# EAGLE design ATCUxxxl3U_Synth_4layer (EAGLE 5.11)
MPN: BZT55C3V6; OC_NEWARK: 01P3361

## Sheet 1 of 9
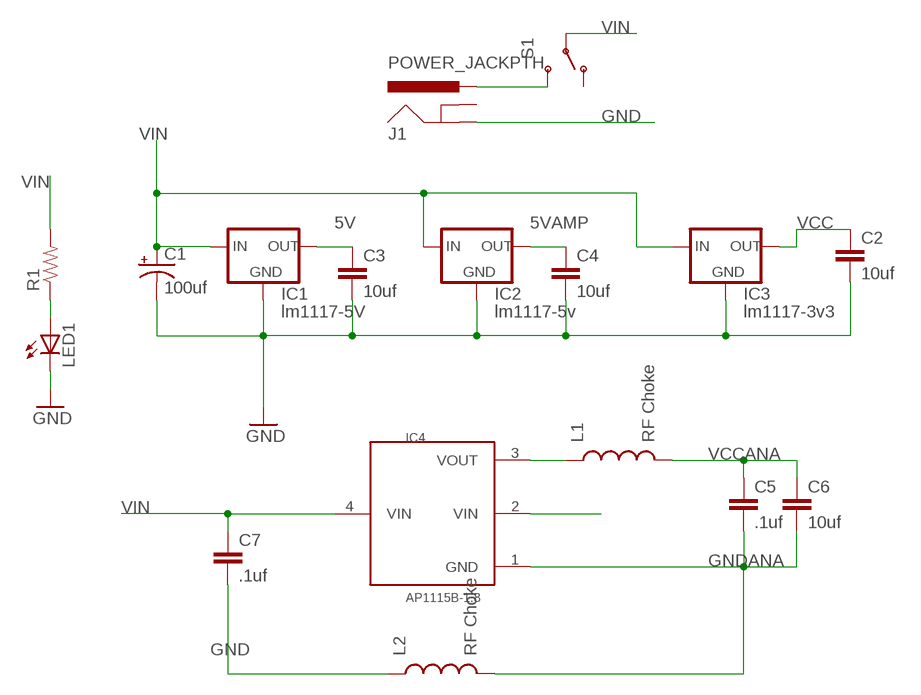
[diagram p0: schematic, sheet 1]

### Parts
C1  100uf  CAP_POL7343  [EIA7343]
C2  10uf  CAP0805  [0805]
C3  10uf  CAP0805  [0805]
C4  10uf  CAP0805  [0805]
C5  .1uf  CAP0805  [0805]
C6  10uf  CAP0805  [0805]
C7  .1uf  CAP0805  [0805]
IC1  lm1117-5V  V-REG-3_LM1117  [V-REG-3_SOT223]
IC2  lm1117-5v  V-REG-3_LM1117  [V-REG-3_SOT223]
IC3  lm1117-3v3  V-REG-3_LM1117  [V-REG-3_SOT223]
IC4  AP1115B-1.8  AP1115  [SOT89-3L]
J1  POWER_JACKPTH  [POWER_JACK_PTH]
L1  RF Choke  INDUCTOR0805  [0805]
L2  RF Choke  INDUCTOR0805  [0805]
LED1  LEDCHIPLED_1206  [CHIPLED_1206]
R1  RESISTOR0805-RES  [0805]
S1  SWITCH-SPSTPTH  [SWITCH-SPDT]

### Nets
5V: C3.1 IC1.2(OUT) ; also sheet 6
5VAMP: C4.1 IC2.2(OUT) ; also sheet 4
GND: C1.C(-) C2.2 C3.2 C4.2 C7.2 IC1.1(GND) IC2.1(GND) IC3.1(GND) J1.GND L2.1 LED1.C ; also sheet 2,4,5,6,7,8
GNDANA: C5.2 C6.2 IC4.1(GND) L2.2 ; also sheet 2,5
N$20: J1.PWR S1.3(S)
N$23: LED1.A R1.1
N$26: IC4.3(VOUT) L1.1
VCC: C2.1 IC3.2(OUT) ; also sheet 2,5,6,7
VCCANA: C5.1 C6.1 L1.2 ; also sheet 2,5
VIN: C1.A(+) C7.1 IC1.3(IN) IC2.3(IN) IC3.3(IN) IC4.2(VIN) IC4.4(VIN) R1.2 S1.2(P)
Unconnected: J1.GNDBREAK S1.1(O)

## Sheet 2 of 9
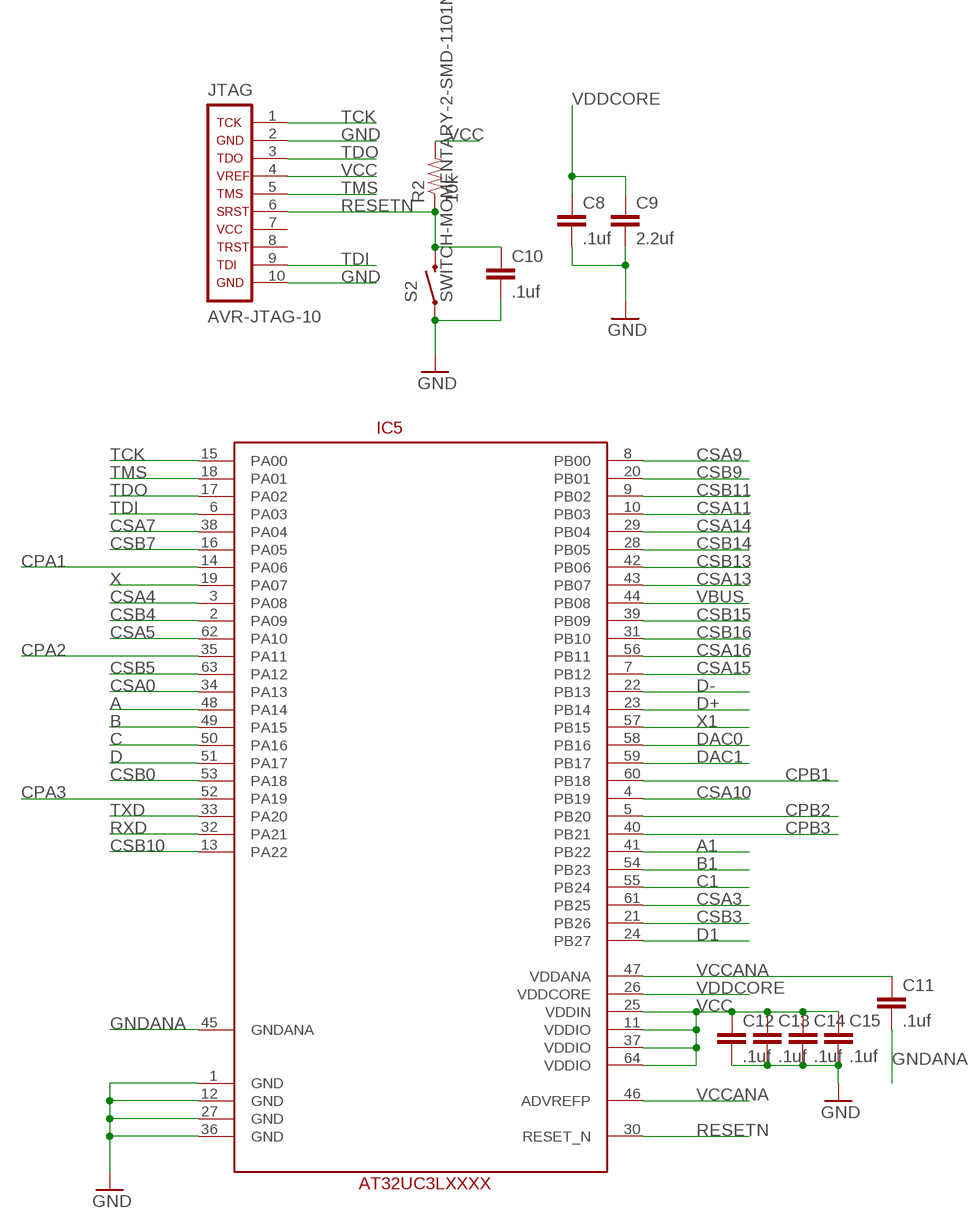
[diagram p1: schematic, sheet 2]

### Parts
C8  .1uf  CAP0805  [0805]
C9  2.2uf  CAP0805  [0805]
C10  .1uf  CAP0805  [0805]
C11  .1uf  CAP0805  [0805]
C12  .1uf  CAP0805  [0805]
C13  .1uf  CAP0805  [0805]
C14  .1uf  CAP0805  [0805]
C15  .1uf  CAP0805  [0805]
IC5  ATCXXXL3U  [TQFP64]
JTAG  AVR-JTAG-10  [AVR-JTAG-10]
R2  10k  RESISTOR0805-RES  [0805]
S2  SWITCH-MOMENTARY-2-SMD-1101NE  [TACTILE-SWITCH-1101NE]

### Nets
A: IC5.48(PA14) ; also sheet 7
A1: IC5.41(PB22) ; also sheet 5
B: IC5.49(PA15) ; also sheet 7
B1: IC5.54(PB23) ; also sheet 5
C: IC5.50(PA16) ; also sheet 7
C1: IC5.55(PB24) ; also sheet 5
CPA1: IC5.14(PA06) ; also sheet 9
CPA2: IC5.35(PA11) ; also sheet 9
CPA3: IC5.52(PA19) ; also sheet 9
CPB1: IC5.60(PB18) ; also sheet 9
CPB2: IC5.5(PB20) ; also sheet 9
CPB3: IC5.40(PB21) ; also sheet 9
CSA0: IC5.34(PA13) ; also sheet 3
CSA3: IC5.61(PB25) ; also sheet 3
CSA4: IC5.3(PA08) ; also sheet 3
CSA5: IC5.62(PA10) ; also sheet 3
CSA7: IC5.38(PA04) ; also sheet 3
CSA9: IC5.8(PB00) ; also sheet 3
CSA10: IC5.4(PB19) ; also sheet 3
CSA11: IC5.10(PB03) ; also sheet 3
CSA13: IC5.43(PB07) ; also sheet 3
CSA14: IC5.29(PB04) ; also sheet 3
CSA15: IC5.7(PB12) ; also sheet 3
CSA16: IC5.56(PB11) ; also sheet 3
CSB0: IC5.53(PA18) ; also sheet 3
CSB3: IC5.21(PB26) ; also sheet 3
CSB4: IC5.2(PA09) ; also sheet 3
CSB5: IC5.63(PA12) ; also sheet 3
CSB7: IC5.16(PA05) ; also sheet 3
CSB9: IC5.20(PB01) ; also sheet 3
CSB10: IC5.13(PA22) ; also sheet 3
CSB11: IC5.9(PB02) ; also sheet 3
CSB13: IC5.42(PB06) ; also sheet 3
CSB14: IC5.28(PB05) ; also sheet 3
CSB15: IC5.39(PB09) ; also sheet 3
CSB16: IC5.31(PB10) ; also sheet 3
D: IC5.51(PA17) ; also sheet 7
D1: IC5.24(PB27) ; also sheet 5
D+: IC5.23(PB14) ; also sheet 8
D-: IC5.22(PB13) ; also sheet 8
DAC0: IC5.58(PB16) ; also sheet 4
DAC1: IC5.59(PB17) ; also sheet 4
GND: C8.2 C9.2 C10.2 C12.2 C13.2 C14.2 C15.2 IC5.1(GND) IC5.12(GND) IC5.27(GND) IC5.36(GND) JTAG.2 JTAG.10 S2.P$1 ; also sheet 1,4,5,6,7,8
GNDANA: C11.2 IC5.45(GNDANA) ; also sheet 1,5
RESETN: C10.1 IC5.30(RESET_N) JTAG.6 R2.1 S2.P$2
RXD: IC5.32(PA21) ; also sheet 6
TCK: IC5.15(PA00) JTAG.1
TDI: IC5.6(PA03) JTAG.9
TDO: IC5.17(PA02) JTAG.3
TMS: IC5.18(PA01) JTAG.5
TXD: IC5.33(PA20) ; also sheet 6
VBUS: IC5.44(PB08) ; also sheet 8
VCC: C12.1 C13.1 C14.1 C15.1 IC5.11(VDDIO) IC5.25(VDDIN) IC5.37(VDDIO) IC5.64(VDDIO) JTAG.4 R2.2 ; also sheet 1,5,6,7
VCCANA: C11.1 IC5.46(ADVREFP) IC5.47(VDDANA) ; also sheet 1,5
VDDCORE: C8.1 C9.1 IC5.26(VDDCORE)
X: IC5.19(PA07) ; also sheet 7
X1: IC5.57(PB15) ; also sheet 5
Unconnected: JTAG.7 JTAG.8

## Sheet 3 of 9
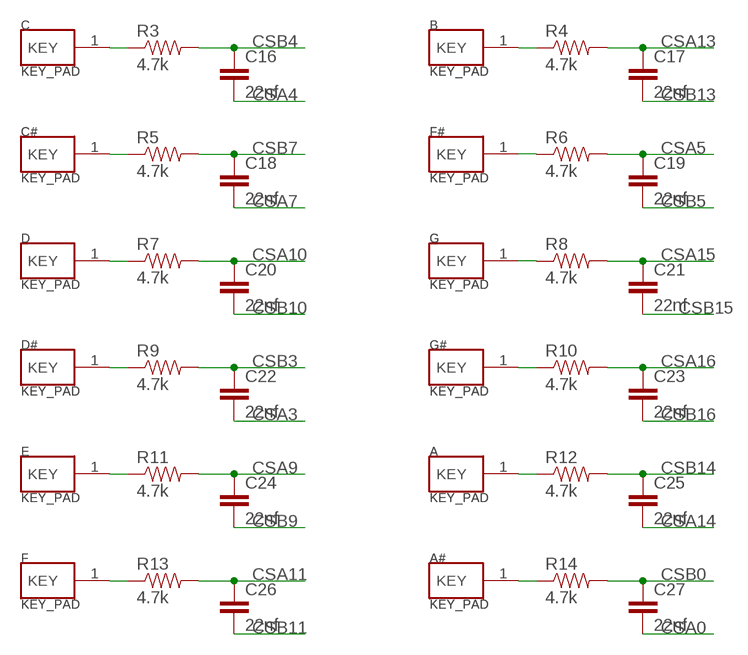
[diagram p2: schematic, sheet 3]

### Parts
A  KEY_PAD  [KEY_PAD]
A#  KEY_PAD  [KEY_PAD]
B  KEY_PAD  [KEY_PAD]
C  KEY_PAD  [KEY_PAD]
C16  22nf  CAP0805  [0805]
C17  22nf  CAP0805  [0805]
C18  22nf  CAP0805  [0805]
C19  22nf  CAP0805  [0805]
C20  22nf  CAP0805  [0805]
C21  22nf  CAP0805  [0805]
C22  22nf  CAP0805  [0805]
C23  22nf  CAP0805  [0805]
C24  22nf  CAP0805  [0805]
C25  22nf  CAP0805  [0805]
C26  22nf  CAP0805  [0805]
C27  22nf  CAP0805  [0805]
C#  KEY_PAD  [KEY_PAD]
D  KEY_PAD  [KEY_PAD]
D#  KEY_PAD  [KEY_PAD]
E  KEY_PAD  [KEY_PAD]
F  KEY_PAD  [KEY_PAD]
F#  KEY_PAD  [KEY_PAD]
G  KEY_PAD  [KEY_PAD]
G#  KEY_PAD  [KEY_PAD]
R3  4.7k  RESISTOR0805-RES  [0805]
R4  4.7k  RESISTOR0805-RES  [0805]
R5  4.7k  RESISTOR0805-RES  [0805]
R6  4.7k  RESISTOR0805-RES  [0805]
R7  4.7k  RESISTOR0805-RES  [0805]
R8  4.7k  RESISTOR0805-RES  [0805]
R9  4.7k  RESISTOR0805-RES  [0805]
R10  4.7k  RESISTOR0805-RES  [0805]
R11  4.7k  RESISTOR0805-RES  [0805]
R12  4.7k  RESISTOR0805-RES  [0805]
R13  4.7k  RESISTOR0805-RES  [0805]
R14  4.7k  RESISTOR0805-RES  [0805]

### Nets
CSA0: C27.2 ; also sheet 2
CSA3: C22.2 ; also sheet 2
CSA4: C16.2 ; also sheet 2
CSA5: C19.1 R6.2 ; also sheet 2
CSA7: C18.2 ; also sheet 2
CSA9: C24.1 R11.2 ; also sheet 2
CSA10: C20.1 R7.2 ; also sheet 2
CSA11: C26.1 R13.2 ; also sheet 2
CSA13: C17.1 R4.2 ; also sheet 2
CSA14: C25.2 ; also sheet 2
CSA15: C21.1 R8.2 ; also sheet 2
CSA16: C23.1 R10.2 ; also sheet 2
CSB0: C27.1 R14.2 ; also sheet 2
CSB3: C22.1 R9.2 ; also sheet 2
CSB4: C16.1 R3.2 ; also sheet 2
CSB5: C19.2 ; also sheet 2
CSB7: C18.1 R5.2 ; also sheet 2
CSB9: C24.2 ; also sheet 2
CSB10: C20.2 ; also sheet 2
CSB11: C26.2 ; also sheet 2
CSB13: C17.2 ; also sheet 2
CSB14: C25.1 R12.2 ; also sheet 2
CSB15: C21.2 ; also sheet 2
CSB16: C23.2 ; also sheet 2
N$1: C.1(KEY) R3.1
N$2: C#.1(KEY) R5.1
N$3: D.1(KEY) R7.1
N$4: D#.1(KEY) R9.1
N$5: E.1(KEY) R11.1
N$6: F.1(KEY) R13.1
N$7: A#.1(KEY) R14.1
N$8: B.1(KEY) R4.1
N$9: A.1(KEY) R12.1
N$10: G#.1(KEY) R10.1
N$11: G.1(KEY) R8.1
N$12: F#.1(KEY) R6.1

## Sheet 4 of 9
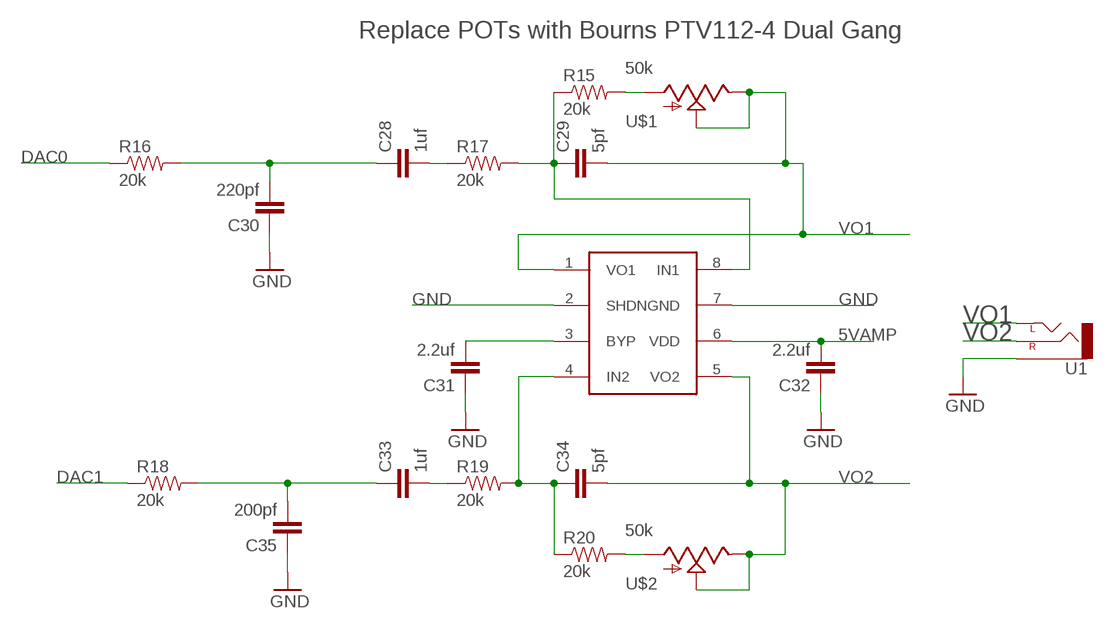
[diagram p3: schematic, sheet 4]

### Parts
C28  1uf  CAP0805  [0805]
C29  5pf  CAP0805  [0805]
C30  220pf  CAP0805  [0805]
C31  2.2uf  CAP0805  [0805]
C32  2.2uf  CAP0805  [0805]
C33  1uf  CAP0805  [0805]
C34  5pf  CAP0805  [0805]
C35  200pf  CAP0805  [0805]
IC6  TPA302  [SO-08]
R15  20k  RESISTOR0805-RES  [0805]
R16  20k  RESISTOR0805-RES  [0805]
R17  20k  RESISTOR0805-RES  [0805]
R18  20k  RESISTOR0805-RES  [0805]
R19  20k  RESISTOR0805-RES  [0805]
R20  20k  RESISTOR0805-RES  [0805]
U1  AUDIO-JACKSMD2  [AUDIO-JACK-3.5MM-SMD]
U$1  50k  POT  [ALPS_POT]
U$2  50k  POT  [ALPS_POT]

### Nets
5VAMP: C32.2 IC6.6(VDD) ; also sheet 1
DAC0: R16.1 ; also sheet 2
DAC1: R18.1 ; also sheet 2
GND: C30.1 C31.1 C32.1 C35.1 IC6.2(SHDN) IC6.7(GND) U1.SLEEVE ; also sheet 1,2,5,6,7,8
N$13: C28.2 R17.1
N$14: C29.1 IC6.8(IN1) R15.1 R17.2
N$15: C33.2 R19.1
N$16: C34.1 IC6.4(IN2) R19.2 R20.1
N$17: R15.2 U$1.P$3(A)
N$18: R20.2 U$2.P$3(A)
N$19: C31.2 IC6.3(BYP)
N$37: C28.1 C30.2 R16.2
N$38: C33.1 C35.2 R18.2
VO1: C29.2 IC6.1(VO1) U1.TIP(LEFT) U$1.P$1(E) U$1.P$2(S)
VO2: C34.2 IC6.5(VO2) U1.RING(RIGHT) U$2.P$1(E) U$2.P$2(S)

### Notes on the sheet
- Replace POTs with Bourns PTV112-4 Dual Gang

## Sheet 5 of 9
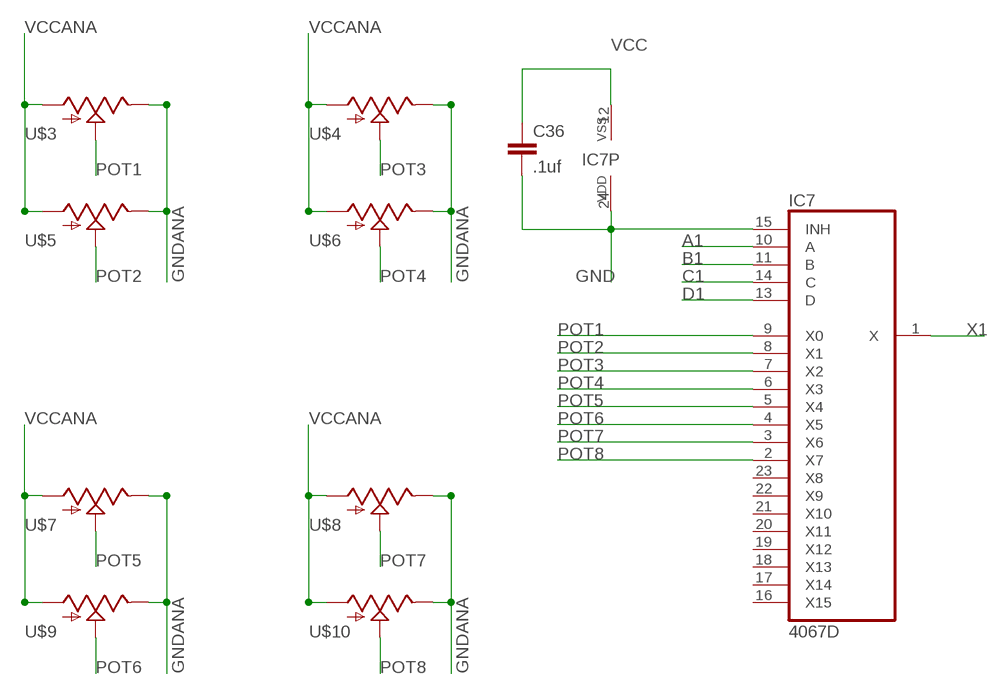
[diagram p4: schematic, sheet 5]

### Parts
C36  .1uf  CAP0805  [0805]
IC7  4067D  [SO24W]
U$3  POT  [ALPS_POT]
U$4  POT  [ALPS_POT]
U$5  POT  [ALPS_POT]
U$6  POT  [ALPS_POT]
U$7  POT  [ALPS_POT]
U$8  POT  [ALPS_POT]
U$9  POT  [ALPS_POT]
U$10  POT  [ALPS_POT]

### Nets
A1: IC7.10(A) ; also sheet 2
B1: IC7.11(B) ; also sheet 2
C1: IC7.14(C) ; also sheet 2
D1: IC7.13(D) ; also sheet 2
GND: C36.2 IC7.15(INH) IC7.24(VDD) ; also sheet 1,2,4,6,7,8
GNDANA: U$3.P$1(E) U$4.P$1(E) U$5.P$1(E) U$6.P$1(E) U$7.P$1(E) U$8.P$1(E) U$9.P$1(E) U$10.P$1(E) ; also sheet 1,2
POT1: IC7.9(X0) U$3.P$2(S)
POT2: IC7.8(X1) U$5.P$2(S)
POT3: IC7.7(X2) U$4.P$2(S)
POT4: IC7.6(X3) U$6.P$2(S)
POT5: IC7.5(X4) U$7.P$2(S)
POT6: IC7.4(X5) U$9.P$2(S)
POT7: IC7.3(X6) U$8.P$2(S)
POT8: IC7.2(X7) U$10.P$2(S)
VCC: C36.1 IC7.12(VSS) ; also sheet 1,2,6,7
VCCANA: U$3.P$3(A) U$4.P$3(A) U$5.P$3(A) U$6.P$3(A) U$7.P$3(A) U$8.P$3(A) U$9.P$3(A) U$10.P$3(A) ; also sheet 1,2
X1: IC7.1(X) ; also sheet 2
Unconnected: IC7.16(X15) IC7.17(X14) IC7.18(X13) IC7.19(X12) IC7.20(X11) IC7.21(X10) IC7.22(X9) IC7.23(X8)

## Sheet 6 of 9
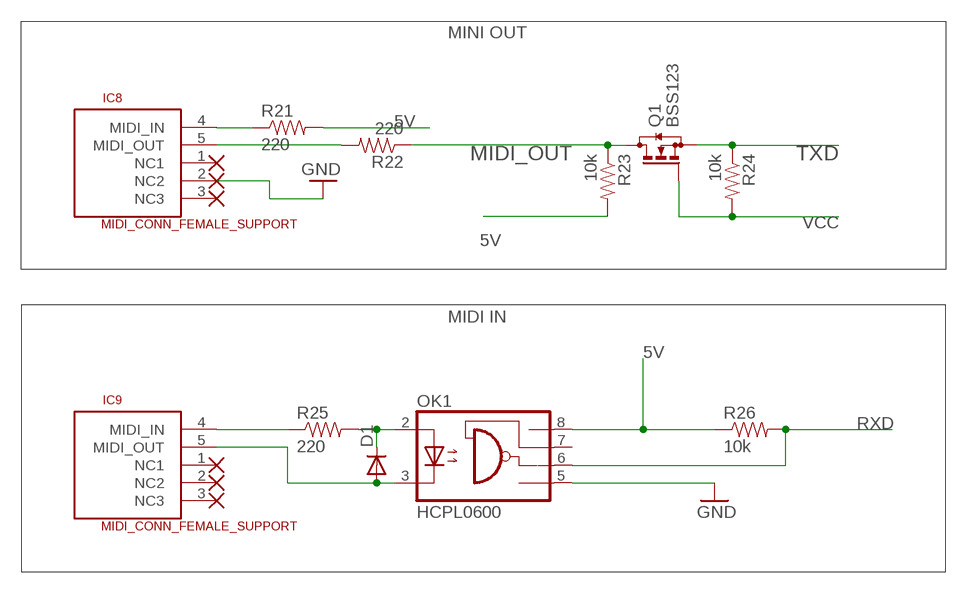
[diagram p5: schematic, sheet 6]

### Parts
D1  DIODESMA  [SMA-DIODE]
IC8  MIDI_CONN_FEMALE_SUPPORT  [DIN_5_FEMALE_SUPPORT]
IC9  MIDI_CONN_FEMALE_SUPPORT  [DIN_5_FEMALE_SUPPORT]
OK1  HCPL0600  [SOIC08]
Q1  BSS123  [SOT23]
R21  220  RESISTOR0805-RES  [0805]
R22  220  RESISTOR0805-RES  [0805]
R23  10k  RESISTOR0805-RES  [0805]
R24  10k  RESISTOR0805-RES  [0805]
R25  220  RESISTOR0805-RES  [0805]
R26  10k  RESISTOR0805-RES  [0805]

### Nets
5V: OK1.8(VCC) R21.2 R23.2 R26.1 ; also sheet 1
GND: IC8.2(NC2) OK1.5(GND) ; also sheet 1,2,4,5,7,8
MIDI_OUT: Q1.3(D) R22.1 R23.1
N$22: IC8.5(MIDI_OUT) R22.2
N$28: D1.C OK1.2(A) R25.2
N$68: IC8.4(MIDI_IN) R21.1
N$72: IC9.4(MIDI_IN) R25.1
N$73: D1.A IC9.5(MIDI_OUT) OK1.3(C)
RXD: OK1.6(VO) R26.2 ; also sheet 2
TXD: Q1.2(S) R24.1 ; also sheet 2
VCC: Q1.1(G) R24.2 ; also sheet 1,2,5,7
Unconnected: IC8.1(NC1) IC8.3(NC3) IC9.1(NC1) IC9.2(NC2) IC9.3(NC3) OK1.7(VE)

### Notes on the sheet
- MINI OUT
- MIDI IN

## Sheet 7 of 9
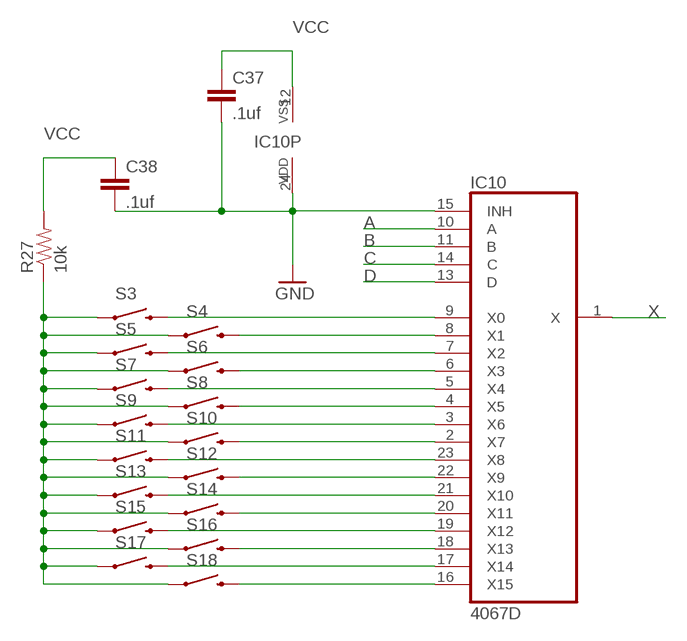
[diagram p6: schematic, sheet 7]

### Parts
C37  .1uf  CAP0805  [0805]
C38  .1uf  CAP0805  [0805]
IC10  4067D  [SO24W]
R27  10k  RESISTOR0805-RES  [0805]
S3  SWITCH-MOMENTARY-2-SMD-1101NE  [TACTILE-SWITCH-1101NE]
S4  SWITCH-MOMENTARY-2-SMD-1101NE  [TACTILE-SWITCH-1101NE]
S5  SWITCH-MOMENTARY-2-SMD-1101NE  [TACTILE-SWITCH-1101NE]
S6  SWITCH-MOMENTARY-2-SMD-1101NE  [TACTILE-SWITCH-1101NE]
S7  SWITCH-MOMENTARY-2-SMD-1101NE  [TACTILE-SWITCH-1101NE]
S8  SWITCH-MOMENTARY-2-SMD-1101NE  [TACTILE-SWITCH-1101NE]
S9  SWITCH-MOMENTARY-2-SMD-1101NE  [TACTILE-SWITCH-1101NE]
S10  SWITCH-MOMENTARY-2-SMD-1101NE  [TACTILE-SWITCH-1101NE]
S11  SWITCH-MOMENTARY-2-SMD-1101NE  [TACTILE-SWITCH-1101NE]
S12  SWITCH-MOMENTARY-2-SMD-1101NE  [TACTILE-SWITCH-1101NE]
S13  SWITCH-MOMENTARY-2-SMD-1101NE  [TACTILE-SWITCH-1101NE]
S14  SWITCH-MOMENTARY-2-SMD-1101NE  [TACTILE-SWITCH-1101NE]
S15  SWITCH-MOMENTARY-2-SMD-1101NE  [TACTILE-SWITCH-1101NE]
S16  SWITCH-MOMENTARY-2-SMD-1101NE  [TACTILE-SWITCH-1101NE]
S17  SWITCH-MOMENTARY-2-SMD-1101NE  [TACTILE-SWITCH-1101NE]
S18  SWITCH-MOMENTARY-2-SMD-1101NE  [TACTILE-SWITCH-1101NE]

### Nets
A: IC10.10(A) ; also sheet 2
B: IC10.11(B) ; also sheet 2
C: IC10.14(C) ; also sheet 2
D: IC10.13(D) ; also sheet 2
GND: C37.2 C38.2 IC10.15(INH) IC10.24(VDD) ; also sheet 1,2,4,5,6,8
N$41: R27.1 S3.P$1 S4.P$1 S5.P$1 S6.P$1 S7.P$1 S8.P$1 S9.P$1 S10.P$1 S11.P$1 S12.P$1 S13.P$1 S14.P$1 S15.P$1 S16.P$1 S17.P$1 S18.P$1
N$43: IC10.9(X0) S3.P$2
N$44: IC10.8(X1) S4.P$2
N$46: IC10.7(X2) S5.P$2
N$47: IC10.6(X3) S6.P$2
N$48: IC10.5(X4) S7.P$2
N$49: IC10.4(X5) S8.P$2
N$50: IC10.3(X6) S9.P$2
N$51: IC10.2(X7) S10.P$2
N$52: IC10.23(X8) S11.P$2
N$53: IC10.22(X9) S12.P$2
N$54: IC10.21(X10) S13.P$2
N$55: IC10.20(X11) S14.P$2
N$56: IC10.19(X12) S15.P$2
N$57: IC10.18(X13) S16.P$2
N$58: IC10.17(X14) S17.P$2
N$59: IC10.16(X15) S18.P$2
VCC: C37.1 C38.1 IC10.12(VSS) R27.2 ; also sheet 1,2,5,6
X: IC10.1(X) ; also sheet 2

## Sheet 8 of 9
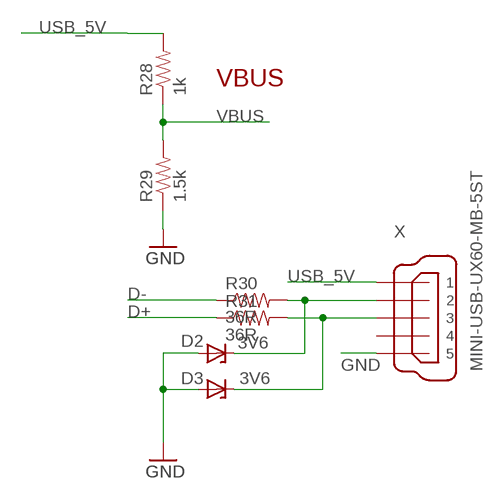
[diagram p7: schematic, sheet 8]

### Parts
D2  3V6  ZENER-DIODESOD80C  [SOD80C]
D3  3V6  ZENER-DIODESOD80C  [SOD80C]
R28  1k  RESISTOR0805-RES  [0805]
R29  1.5k  RESISTOR0805-RES  [0805]
R30  36R  RESISTOR0805-RES  [0805]
R31  36R  RESISTOR0805-RES  [0805]
X  MINI-USB-UX60-MB-5ST  [UX60-MB-5ST]

### Nets
D+: R31.1 ; also sheet 2
D-: R30.1 ; also sheet 2
GND: D2.A D3.A R29.1 X.5 ; also sheet 1,2,4,5,6,7
N$99: D2.C R30.2 X.2
N$100: D3.C R31.2 X.3
USB_5V: R28.2 X.1
VBUS: R28.1 R29.2 ; also sheet 2
Unconnected: X.4

### Notes on the sheet
- VBUS

## Sheet 9 of 9
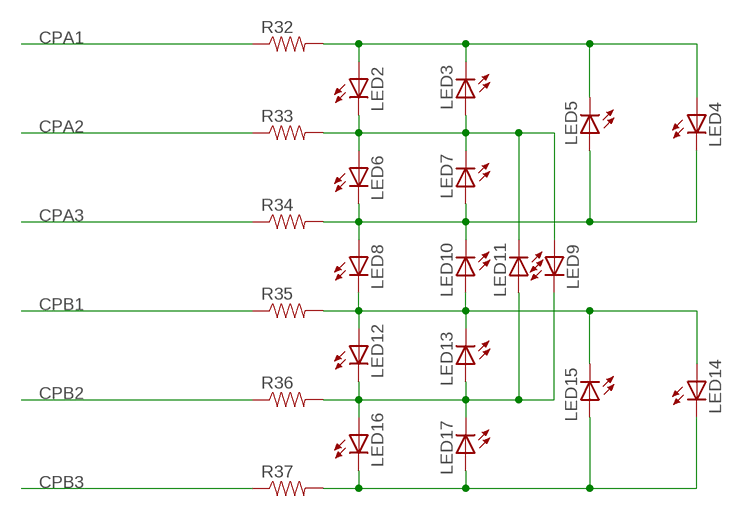
[diagram p8: schematic, sheet 9]

### Parts
LED2  LEDCHIPLED_1206  [CHIPLED_1206]
LED3  LEDCHIPLED_1206  [CHIPLED_1206]
LED4  LEDCHIPLED_1206  [CHIPLED_1206]
LED5  LEDCHIPLED_1206  [CHIPLED_1206]
LED6  LEDCHIPLED_1206  [CHIPLED_1206]
LED7  LEDCHIPLED_1206  [CHIPLED_1206]
LED8  LEDCHIPLED_1206  [CHIPLED_1206]
LED9  LEDCHIPLED_1206  [CHIPLED_1206]
LED10  LEDCHIPLED_1206  [CHIPLED_1206]
LED11  LEDCHIPLED_1206  [CHIPLED_1206]
LED12  LEDCHIPLED_1206  [CHIPLED_1206]
LED13  LEDCHIPLED_1206  [CHIPLED_1206]
LED14  LEDCHIPLED_1206  [CHIPLED_1206]
LED15  LEDCHIPLED_1206  [CHIPLED_1206]
LED16  LEDCHIPLED_1206  [CHIPLED_1206]
LED17  LEDCHIPLED_1206  [CHIPLED_1206]
R32  RESISTOR0805-RES  [0805]
R33  RESISTOR0805-RES  [0805]
R34  RESISTOR0805-RES  [0805]
R35  RESISTOR0805-RES  [0805]
R36  RESISTOR0805-RES  [0805]
R37  RESISTOR0805-RES  [0805]

### Nets
CPA1: R32.1 ; also sheet 2
CPA2: R33.1 ; also sheet 2
CPA3: R34.1 ; also sheet 2
CPB1: R35.1 ; also sheet 2
CPB2: R36.1 ; also sheet 2
CPB3: R37.1 ; also sheet 2
N$24: LED2.A LED3.C LED4.A LED5.C R32.2
N$25: LED4.C LED5.A LED6.C LED7.A LED8.A LED10.C R34.2
N$29: LED2.C LED3.A LED6.A LED7.C LED9.A LED11.C R33.2
N$30: LED8.C LED10.A LED12.A LED13.C LED14.A LED15.C R35.2
N$31: LED14.C LED15.A LED16.C LED17.A R37.2
N$32: LED9.C LED11.A LED12.C LED13.A LED16.A LED17.C R36.2

## Library data of the parts
A A# B C C# D D# E F F# G G# = ATCUxxxl3U_Synth:KEY_PAD
C1 = SparkFun:CAP_POL: Capacitor Polarized These are standard SMD and PTH capacitors. Normally 10uF, 47uF, and 100uF in electrolytic and tantalum varieties. Always verify the external diameter of the through hole cap, it varies with capacity, voltage, and manufacturer. The EIA devices should be standard.
C2-C38 = SparkFun:CAP: Capacitor Standard 0603 ceramic capacitor, and 0.1" leaded capacitor.
D1 = SparkFun:DIODE: Diode These are standard reverse protection diodes and small signal diodes. SMA package can handle up to about 1A. SOD-323 can handle about 200mA. What the SOD-323 package when ordering, there are some mfgs out there that are 5-pin packages.
D2 D3 = diode:ZENER-DIODE: Z-Diode
IC1-IC3 = PWM_ATUC64L4U:V-REG-3_LM1117
IC4 = PWM_ATUC64L4U:AP1115
IC5 = atmel-avr32-michel:ATCXXXL3U
IC6 = ATCUxxxl3U_Synth:TPA302
IC7 IC10 = 40xx:4067: 16-channel ANALOG MULTIPLEXER
IC8 IC9 = SparkFun:MIDI_CONN_FEMALE_SUPPORT
J1 = SparkFun:POWER_JACK: Power Jack This is the standard 5.5mm barrel jack for power. The PTH is the most common, proven, reliable, footprint. All others are experimental. The Slot footprint only works if the mill layer is transmitted to the PCB fab house so be warned. Spark Fun Electronics SKU : PRT-00119. Mating wall wart : TOL-00298 (and others)
JTAG = atmel-avr32-michel:AVR-JTAG-10: AVR JTAG Debug/Programming Header
L1 L2 = SparkFun:INDUCTOR: Inductors Basic Inductor/Choke - 0603 and 1206. Footprints are not proven and vary greatly between part numbers.
LED1-LED17 = led:LED: LED OSRAM: - CHIPLED LG R971, LG N971, LY N971, LG Q971, LY Q971, LO R971, LY R971 LH N974, LH R974 LS Q976, LO Q976, LY Q976 LO Q996 - Hyper CHIPLED LW Q18S LB Q993, LB Q99A, LB R99A - SideLED LS A670, LO A670, LY A670, LG A670, LP A670 LB A673, LV A673, LT A673, LW A673 LH A674 LY A675 LS A676, LA A676, LO A676, LY A676, LW A676 LS A679, LY A679, LG A679 - Hyper Micro SIDELED® LS Y876, LA Y876, LO Y876, LY Y876 LT Y87S - SmartLED LW L88C, LW L88S LB L89C, LB L89S, LG L890 LS L89K, LO L89K, LY L89K LS L896, LA L896, LO L896, LY L896 - TOPLED LS T670, LO T670, LY T670, LG T670, LP T670 LSG T670, LSP T670, LSY T670, LOP T670, LYG T670 LG T671, LOG T671, LSG T671 LB T673, LV T673, LT T673, LW T673 LH T674 LS T676, LA T676, LO T676, LY T676, LB T676, LH T676, LSB T676, LW T676 LB T67C, LV T67C, LT T67C, LS T67K, LO T67K, LY T67K, LW E67C LS E67B, LA E67B, LO E67B, LY E67B, LB E67C, LV E67C, LT E67C LW T67C LS T679, LY T679, LG T679 LS T770, LO T770, LY T770, LG T770, LP T770 LB T773, LV T773, LT T773, LW T773 LH T774 LS E675, LA E675, LY E675, LS T675 LS T776, LA T776, LO T776, LY T776, LB T776 LHGB T686 LT T68C, LB T68C - Hyper Mini TOPLED® LB M676 - Mini TOPLED Santana® LG M470 LS M47K, LO M47K, LY M47K Source: http://www.osram.convergy.de LUXEON: - LUMILED® LXK2-PW12-R00, LXK2-PW12-S00, LXK2-PW14-U00, LXK2-PW14-V00 LXK2-PM12-R00, LXK2-PM12-S00, LXK2-PM14-U00 LXK2-PE12-Q00, LXK2-PE12-R00, LXK2-PE12-S00, LXK2-PE14-T00, LXK2-PE14-U00 LXK2-PB12-K00, LXK2-PB12-L00, LXK2-PB12-M00, LXK2-PB14-N00, LXK2-PB14-P00, LXK2-PB14-Q00 LXK2-PR12-L00, LXK2-PR12-M00, LXK2-PR14-Q00, LXK2-PR14-R00 LXK2-PD12-Q00, LXK2-PD12-R00, LXK2-PD12-S00 LXK2-PH12-R00, LXK2-PH12-S00 LXK2-PL12-P00, LXK2-PL12-Q00, LXK2-PL12-R00 Source: www.luxeon.com KINGBRIGHT: KA-3528ASYC Source: www.kingbright.com
OK1 = optocoupler:HCPL0600: HEWLETT PACKARD OPTO COUPLER; MF: AGILENT TECHNOLOGIES; MPN: HCPL-0600-000E; OC_FARNELL: 9994696; OC_NEWARK: 88H7774
Q1 = transistor-small-signal:BSS123: N-CHANNEL MOS FET
R1-R37 = SparkFun:RESISTOR: Resistor Basic schematic elements and footprints for 0603, 1206, and PTH resistors.
S1 = SparkFun:SWITCH-SPST: SPST Switch Simple slide switch. Spark Fun Electronics SKU : COM-00102
S2 = table_tiles_tlc:SWITCH-MOMENTARY-2
S3-S18 = SparkFun:SWITCH-MOMENTARY-2
U1 = SparkFun:AUDIO-JACK: 3.5mm Audio Jack Simple 3.5mm common PCB mount audio jack. SKU: PRT-08032
U$1-U$10 = SparkFun:POT
X = con-hirose:MINI-USB-: MINI USB Connector Source: http://www.hirose.co.jp/cataloge_hp/e24000019.pdf; OC_FARNELL: unknown; OC_NEWARK: unknown

## Board
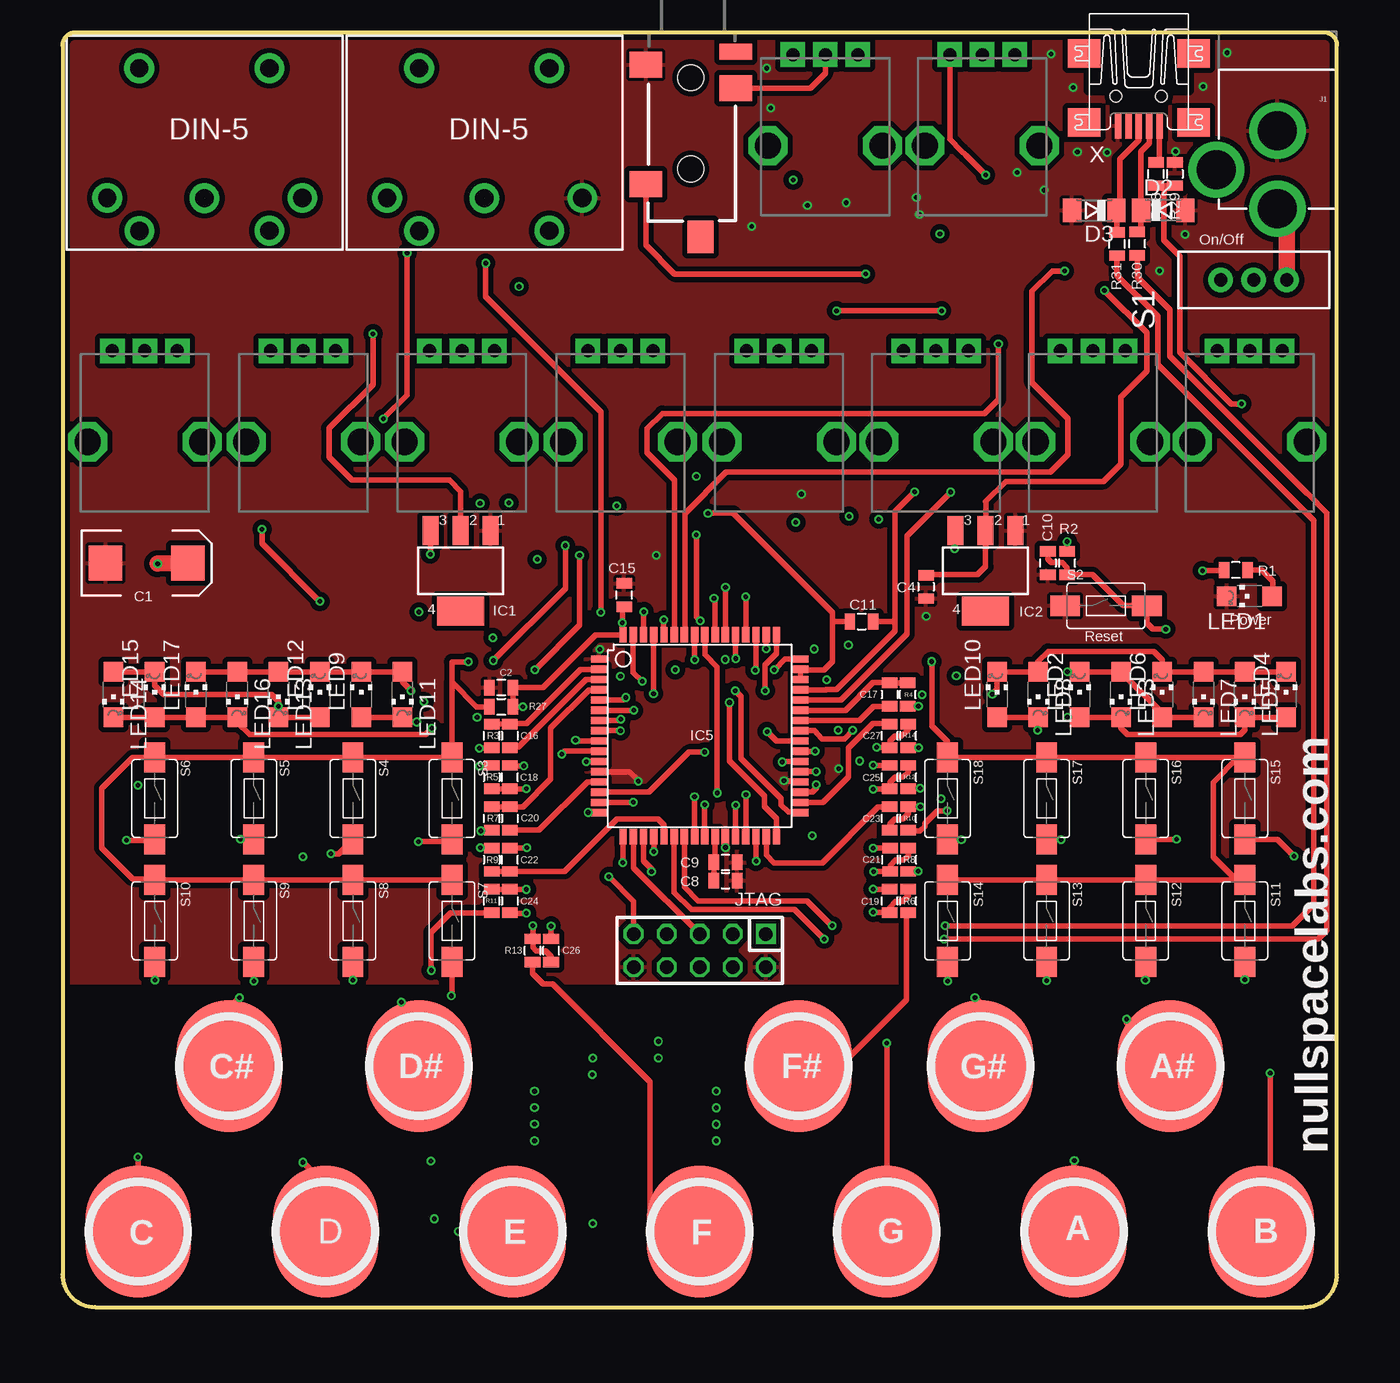
[diagram p9: board, top side]
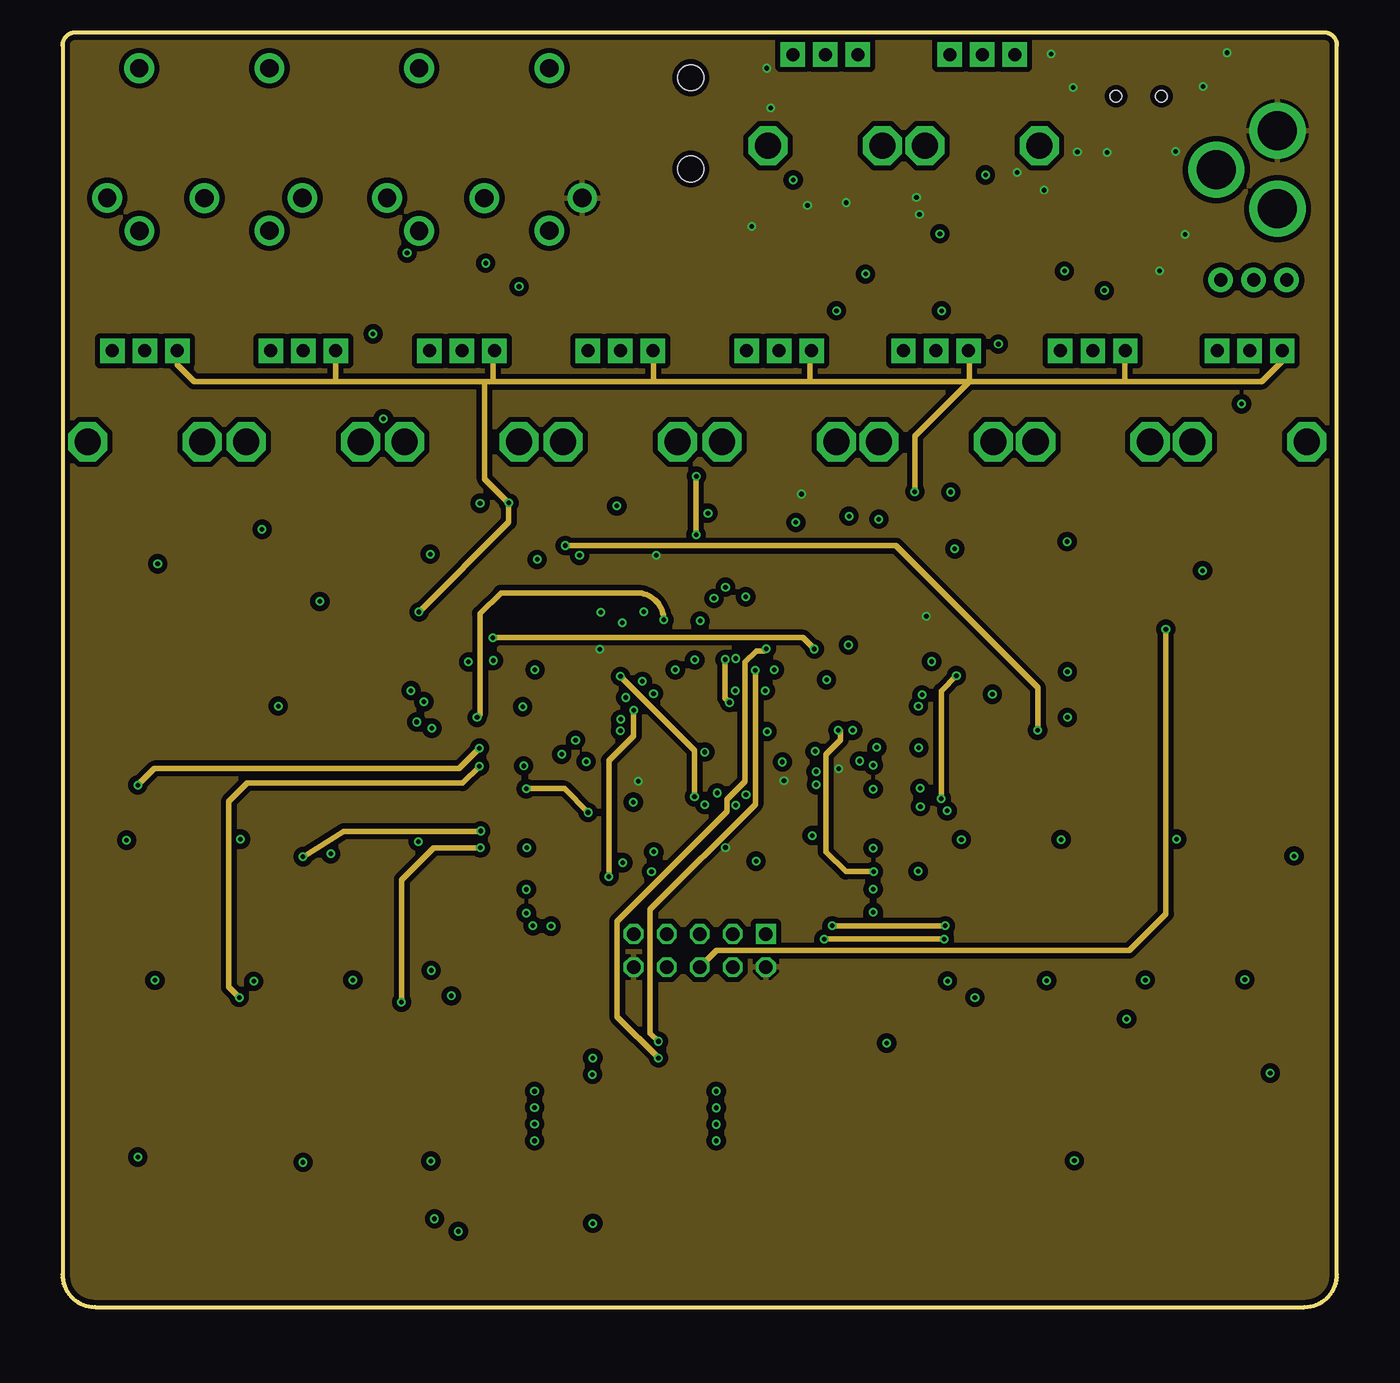
[diagram p10: board, inner layer Route2]
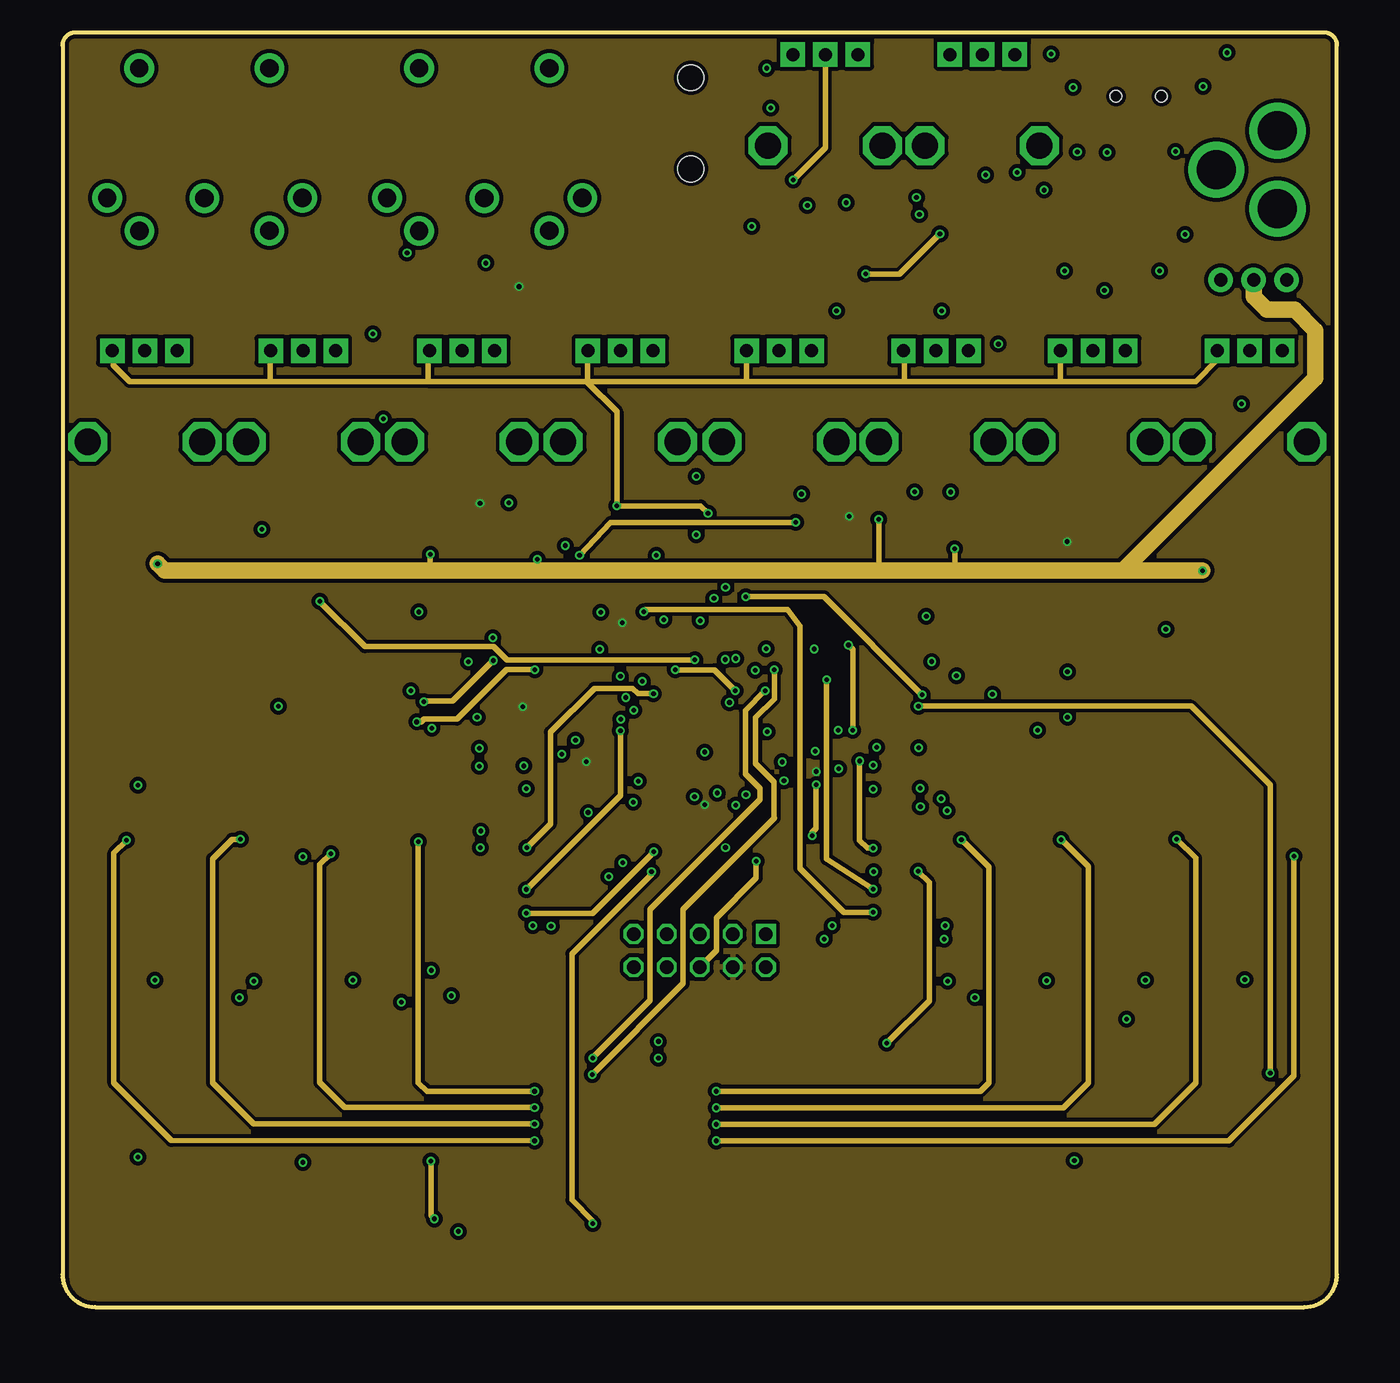
[diagram p11: board, inner layer Route15]
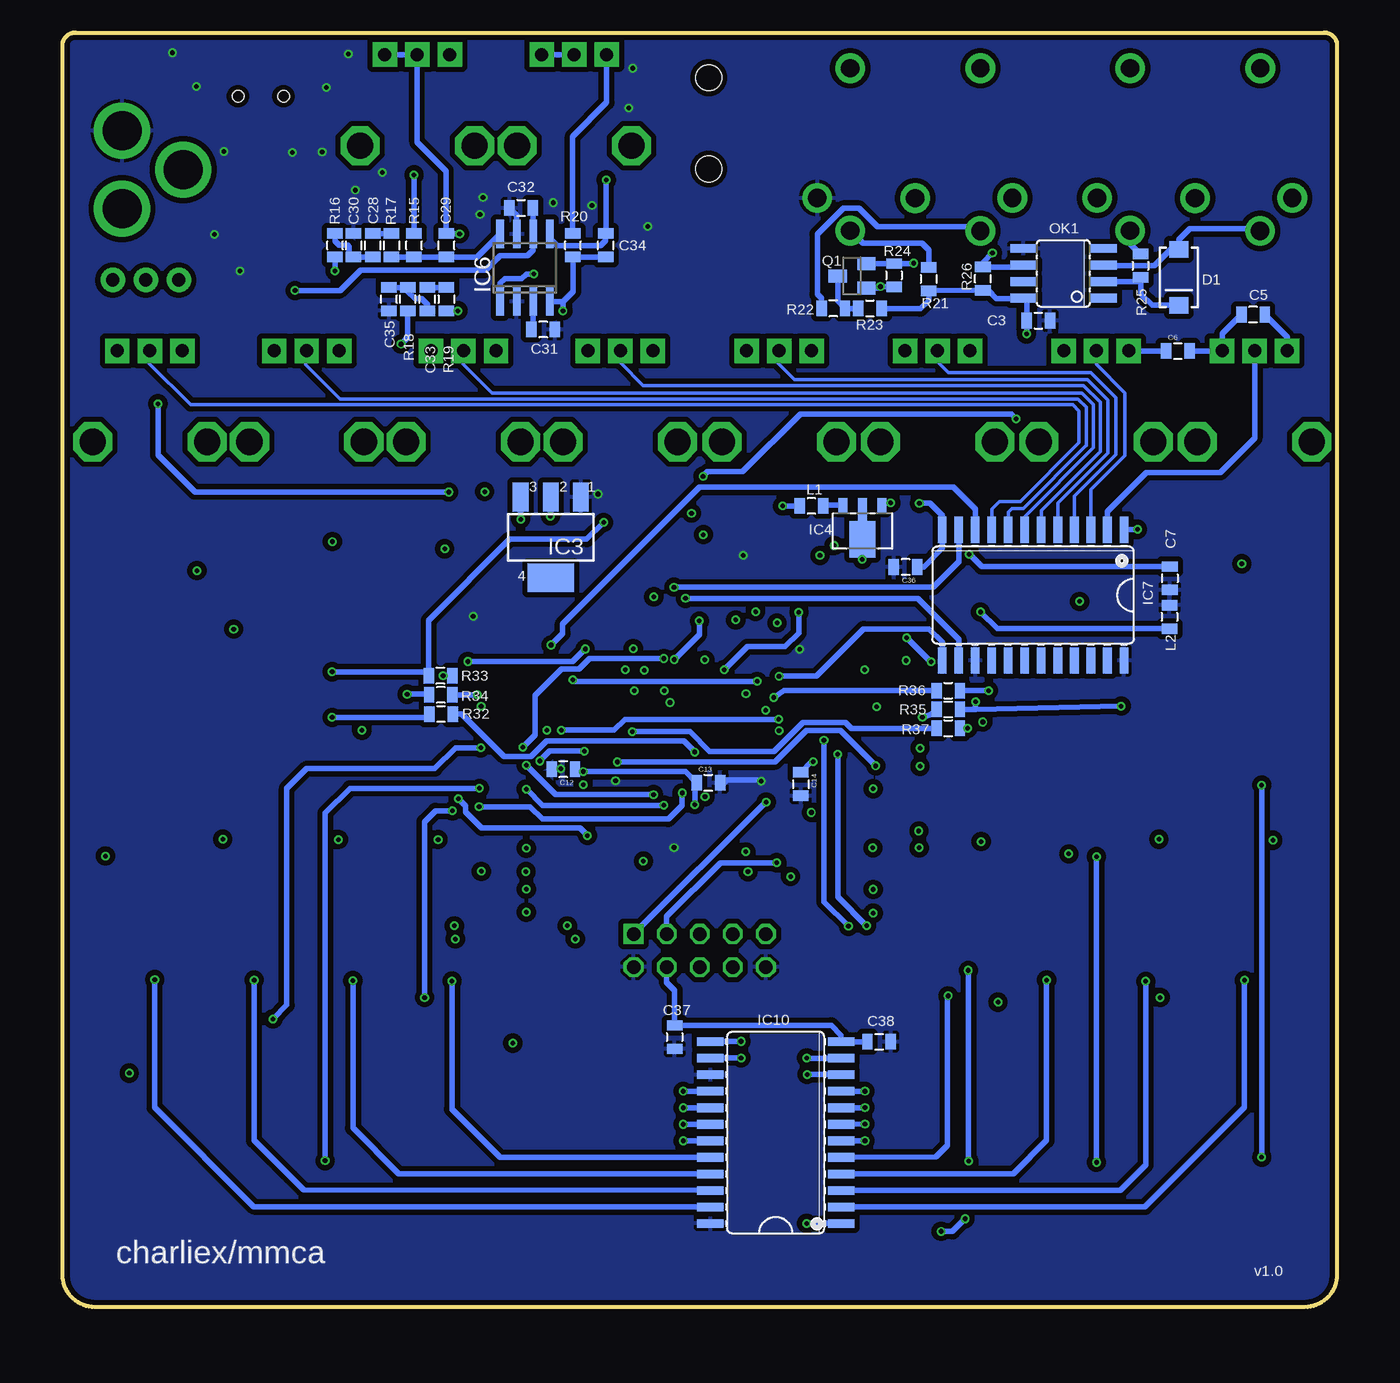
[diagram p12: board, bottom side, seen from below]

Size 98 x 98 mm. Coordinates in mm from the lower left corner, seen from the top.
Outline: 0,2.5 arc90 2.5,0 95.5,0 arc90 98,2.5 98,97 arc90 97,98 1,98 arc90 0,97 0,2.5
Copper layers (1*2+15*16): Top 0.035mm / dielectric 0.2032mm / Route2 0.035mm / dielectric 1.016mm / Route15 0.035mm / dielectric 0.2032mm / Bottom 0.035mm
Design rules "ITead_rule_4layer": minimum track width 6mil, minimum drill 12mil, track to track 6mil, track to pad 6mil, pad to pad 6mil, via to via 6mil, smd to smd 0mil, copper to edge 10mil, drill to drill 10mil, minimum pad ring 10mil, minimum via ring 6mil, stop-mask expansion 2mil, vias tented up to drill 100mil, thermal gap 10mil

### Footprints (pad centres in the part's own frame; a part is rotated, then mirrored left to right if it is on the bottom)
KEY_PAD = smd 8.128 x 10.16: 1 0,0
EIA7343 = smd 2.55 x 2.7: A 3.17,0; C -3.17,0
0805 = smd 0.8 x 1.2: 1 -0.9,0; 2 0.9,0
SMA-DIODE = smd 1.27 x 1.47: A -2.15,0; C 2.15,0
SOD80C = smd 1.4 x 1.8: A 1.7,0; C -1.7,0
V-REG-3_SOT223 = smd 1.219 x 2.235: 1 -2.311,-3.099; 2 0,-3.099; 3 2.311,-3.099 | smd 3.6 x 2.2: 4 0,3.099
SOT89-3L = smd 0.7 x 1.1: 1 -1.5,-1.75; 3 1.5,-1.75 | smd 0.7 x 1.8: 2 0,-1.4 | smd 2 x 2.8: 4 0,0.9
TQFP64 = smd 1.194 x 0.559: 1 -7.76,5.905; 2 -7.76,5.118; 3 -7.76,4.331; 4 -7.76,3.543; 5 -7.76,2.756; 6 -7.76,1.968; 7 -7.76,1.181; 8 -7.76,0.394; 9 -7.76,-0.394; 10 -7.76,-1.181; 11 -7.76,-1.968; 12 -7.76,-2.756; 13 -7.76,-3.543; 14 -7.76,-4.331; 15 -7.76,-5.118; 16 -7.76,-5.905; 33 7.76,-5.905; 34 7.76,-5.118; 35 7.76,-4.331; 36 7.76,-3.543; 37 7.76,-2.756; 38 7.76,-1.968; 39 7.76,-1.181; 40 7.76,-0.394; 41 7.76,0.394; 42 7.76,1.181; 43 7.76,1.968; 44 7.76,2.756; 45 7.76,3.543; 46 7.76,4.331; 47 7.76,5.118; 48 7.76,5.905 | smd 0.559 x 1.194: 17 -5.905,-7.76; 18 -5.118,-7.76; 19 -4.331,-7.76; 20 -3.543,-7.76; 21 -2.756,-7.76; 22 -1.968,-7.76; 23 -1.181,-7.76; 24 -0.394,-7.76; 25 0.394,-7.76; 26 1.181,-7.76; 27 1.968,-7.76; 28 2.756,-7.76; 29 3.543,-7.76; 30 4.331,-7.76; 31 5.118,-7.76; 32 5.905,-7.76; 49 5.905,7.76; 50 5.118,7.76; 51 4.331,7.76; 52 3.543,7.76; 53 2.756,7.76; 54 1.968,7.76; 55 1.181,7.76; 56 0.394,7.76; 57 -0.394,7.76; 58 -1.181,7.76; 59 -1.968,7.76; 60 -2.756,7.76; 61 -3.543,7.76; 62 -4.331,7.76; 63 -5.118,7.76; 64 -5.905,7.76
SO-08 = smd 0.6 x 2.2: 1 -1.905,-2.6; 2 -0.635,-2.6; 3 0.635,-2.6; 4 1.905,-2.6; 5 1.905,2.6; 6 0.635,2.6; 7 -0.635,2.6; 8 -1.905,2.6
SO24W = smd 0.66 x 2.032: 1 -6.985,-5.029; 2 -5.715,-5.029; 3 -4.445,-5.029; 4 -3.175,-5.029; 5 -1.905,-5.029; 6 -0.635,-5.029; 7 0.635,-5.029; 8 1.905,-5.029; 9 3.175,-5.029; 10 4.445,-5.029; 11 5.715,-5.029; 12 6.985,-5.029; 13 6.985,5.029; 14 5.715,5.029; 15 4.445,5.029; 16 3.175,5.029; 17 1.905,5.029; 18 0.635,5.029; 19 -0.635,5.029; 20 -1.905,5.029; 21 -3.175,5.029; 22 -4.445,5.029; 23 -5.715,5.029; 24 -6.985,5.029
DIN_5_FEMALE_SUPPORT = drill 1.4 pad 2.286 round: 1 0.46,3.61; 2 -7.07,3.6; 3 7.94,3.6; 4 -4.53,6.12; 5 5.47,6.13; 6 -4.53,-6.382; 7 5.478,-6.382
POWER_JACK_PTH = drill 2.997 pad 4.318 round: GND 0,7.7; GNDBREAK 4.7,10.7; PWR 0,13.7
AVR-JTAG-10 = drill 1.016 square: 1 -5.08,-1.27 | drill 1.016 octagon: 2 -5.08,1.27; 3 -2.54,-1.27; 4 -2.54,1.27; 5 0,-1.27; 6 0,1.27; 7 2.54,-1.27; 8 2.54,1.27; 9 5.08,-1.27; 10 5.08,1.27
CHIPLED_1206 = smd 1.5 x 1.5: A 0,-1.75; C 0,1.75
SOIC08 = smd 0.66 x 2.032: 1 -1.905,-3.073; 2 -0.635,-3.073; 3 0.635,-3.073; 4 1.905,-3.073; 5 1.905,3.073; 6 0.635,3.073; 7 -0.635,3.073; 8 -1.905,3.073
SOT23 = smd 1 x 1.4: 1 -0.95,-1.1; 2 0.95,-1.1; 3 0,1.1
SWITCH-SPDT = drill 1.016 pad 1.88 round: 1 0,2.54; 2 0,0; 3 0,-2.54
TACTILE-SWITCH-1101NE = smd 2.3 x 1.6: P$1 -3.15,0; P$2 3.15,0
AUDIO-JACK-3.5MM-SMD = smd 2 x 2.5: RING 4.3,3.45; SLEEVE 2.5,-3.45; TIP 11.7,-3.45 | smd 1.2 x 2.5: RSH 1.5,3.45 | smd 2.5 x 2: TSH 15.75,0.75 | hole 2: 3.5,0; 10.5,0
ALPS_POT = drill 1 pad 1.88 square: P$1 7,-2.5; P$2 7,0; P$3 7,2.5 | drill 2 octagon: P$4 0,-4.4; P$5 0,4.4
UX60-MB-5ST = smd 2 x 0.5: 1 2.25,1.6; 2 2.25,0.8; 3 2.25,0; 4 2.25,-0.8; 5 2.25,-1.6 | smd 2.2 x 2.5: M1 -3.3,-4.2; M2 -3.3,4.2; M3 2,4.2; M4 2,-4.2 | hole 0.9: 0,-1.75; 0,1.75

### Placement (x,y rotation side)
A  77.78,5.82 0 top
A#  85.19,18.52 0 top
B  92.18,5.82 0 top
C  5.82,5.82 0 top
C1  6.48,57.2 0 top
C2  33.73,47.63 180 top
C3  22.96,75.85 0 bottom
C4  66.4,55.38 270 top
C5  6.45,76.31 180 bottom
C6  12.25,73.51 0 bottom
C7  12.86,56.04 270 bottom
C8  50.98,32.79 0 top
C9  50.98,34.19 0 top
C10  75.77,57.2 270 top
C11  61.45,52.71 0 top
C12  59.49,41.35 180 bottom
C13  48.34,40.31 0 bottom
C14  41.23,40.21 270 bottom
C15  43.18,54.74 90 top
C16  34.39,43.92 270 top
C17  63.61,47.09 270 top
C18  34.39,40.74 90 top
C19  63.61,31.22 90 top
C20  34.39,37.57 270 top
C21  63.63,34.39 90 top
C22  34.39,34.39 90 top
C23  63.61,37.57 90 top
C24  34.39,31.22 270 top
C25  63.61,40.74 90 top
C26  37.57,27.41 90 top
C27  63.61,43.92 90 top
C28  74.15,81.64 90 bottom
C29  68.48,81.64 90 bottom
C30  75.62,81.64 270 bottom
C31  61.04,75.16 180 bottom
C32  62.74,84.51 0 bottom
C33  69.95,77.5 90 bottom
C34  56.24,81.64 90 bottom
C35  72.9,77.5 90 bottom
C36  33.18,56.9 180 bottom
C37  50.93,20.76 270 bottom
C38  35.21,20.4 0 bottom
C#  12.8,18.52 0 top
D  20.22,5.82 0 top
D1  12.17,79.18 270 bottom
D2  84.64,84.33 0 top
D3  79.33,84.33 180 top
D#  27.41,18.52 0 top
E  34.62,5.82 0 top
F  49,5.82 0 top
F#  56.62,18.52 0 top
G  63.38,5.82 0 top
G#  70.59,18.52 0 top
IC1  30.61,56.62 180 top
IC2  70.97,56.62 180 top
IC3  60.46,59.19 180 bottom
IC4  36.48,59.92 180 bottom
IC5  49,43.92 0 top
IC6  62.44,79.91 0 bottom
IC7  23.37,54.74 180 bottom
IC8  32.9,88.88 180 top
IC9  11.38,88.88 180 top
IC10  43.16,13.41 90 bottom
J1  93.42,98.15 180 top
JTAG  49,27.41 180 top
L1  40.41,61.6 180 bottom
L2  12.88,53.06 270 bottom
LED1  91.27,54.66 90 top
LED2  78.21,47.09 0 top
LED3  81.38,47.09 180 top
LED4  94.09,47.09 0 top
LED5  90.91,47.09 180 top
LED6  84.56,47.09 0 top
LED7  87.73,47.09 180 top
LED8  75.03,47.09 180 top
LED9  22.96,47.09 0 top
LED10  71.86,47.09 0 top
LED11  26.14,47.09 180 top
LED12  19.79,47.09 0 top
LED13  16.62,47.09 180 top
LED14  3.91,47.09 180 top
LED15  7.09,47.09 0 top
LED16  13.44,47.09 180 top
LED17  10.27,47.09 0 top
OK1  21.03,79.48 90 bottom
Q1  37.29,79.28 90 bottom
R1  90.22,56.67 180 top
R2  77.24,57.2 90 top
R3  33,43.92 90 top
R4  65,47.09 90 top
R5  33,40.74 270 top
R6  65.03,31.22 90 top
R7  33,37.57 90 top
R8  65.03,34.39 90 top
R9  33,34.39 270 top
R10  65.03,37.57 90 top
R11  33,31.22 90 top
R12  65.03,40.74 90 top
R13  36.15,27.41 90 top
R14  65.03,43.92 90 top
R15  70.97,81.64 90 bottom
R16  77.04,81.64 90 bottom
R17  72.7,81.64 270 bottom
R18  71.45,77.5 90 bottom
R19  68.48,77.5 270 bottom
R20  58.75,81.64 90 bottom
R21  31.4,79.05 270 bottom
R22  38.74,76.79 180 bottom
R23  35.92,76.79 0 bottom
R24  34.06,79.33 270 bottom
R25  15.12,80.06 270 bottom
R26  27.23,79.07 90 bottom
R27  33.73,46.16 0 top
R28  84.08,87.13 90 top
R29  85.53,87.13 270 top
R30  82.63,81.77 90 top
R31  81.08,81.74 90 top
R32  68.89,45.6 180 bottom
R33  68.94,48.54 180 bottom
R34  68.91,47.07 180 bottom
R35  29.9,45.95 0 bottom
R36  29.9,47.4 0 bottom
R37  29.9,44.5 0 bottom
S1  91.6,78.97 90 top
S2  80.24,53.93 0 top
S3  29.95,39.09 270 top
S4  22.33,39.09 270 top
S5  14.71,39.09 270 top
S6  7.09,39.09 270 top
S7  29.95,29.7 270 top
S8  22.33,29.7 270 top
S9  14.71,29.7 270 top
S10  7.09,29.7 270 top
S11  90.91,29.7 270 top
S12  83.29,29.7 270 top
S13  75.67,29.7 270 top
S14  68.05,29.7 270 top
S15  90.91,39.09 270 top
S16  83.29,39.09 270 top
S17  75.67,39.09 270 top
S18  68.05,39.09 270 top
U1  48.31,98.02 270 top
U$1  70.72,89.31 90 top
U$2  58.65,89.31 90 top
U$3  91.29,66.53 90 top
U$4  67.16,66.53 90 top
U$5  79.23,66.53 90 top
U$6  55.1,66.53 90 top
U$7  42.9,66.53 90 top
U$8  18.52,66.53 90 top
U$9  30.71,66.53 90 top
U$10  6.33,66.53 90 top
X  82.76,93.09 270 top

### Tracks (layer width: path | path; a pad name or v marks a point on that pad's centre or on a via)
5V  (via drill 0.36)
  Top 0.406: v23.88,74.83 23.88,70.95 20.5,67.57 20.5,65.36 22.28,63.58 29.75,63.58 30.61,62.72 IC1.2
  Bottom 0.406: v23.88,74.83 23.86,74.85 C3.1 23.86,77.33 arc-90 OK1.8 24.13,77.55 26.19,77.55 26.82,78.17 R26.1 R21.2 31.4,77.4 32.03,76.76 34.99,76.76 R23.2
5VAMP  (via drill 0.36)
  Top 0.406: C4.1 66.44,56.31 70.36,56.31 70.97,56.92 IC2.2 71,58.37 71,61.9 70.97,61.93 72.52,63.48 80.04,63.48 81.38,64.82 81.38,70.01 81.41,70.01 83.37,71.96 83.37,74.91 v80.11,78.16
  Bottom 0.406: C32.2 61.8,84.47 IC6.6 61.83,82.49 61.8,82.46 61.8,81.28 62.23,80.85 64.37,80.85 65.48,79.73 75.09,79.73 76.66,78.16 v80.11,78.16
A  (via drill 0.36)
  Top 0.406: v54.74,49 55.57,49.83 IC5.48
  Route15 0.406: v40.74,17.89 47.73,24.87 47.73,30.59 54.74,37.59 54.72,37.62 54.72,40.36 53.29,41.79 53.29,45.32 54.74,46.77 v54.74,49
  Bottom 0.406: IC10.10 38.15,17.89 v40.74,17.89
A1  (via drill 0.36)
  Top 0.406: v60.76,44.35 60.12,43.67 58.4,43.67 57.8,44.31 IC5.41
  Route15 0.406: v60.43,50.91 60.76,50.58 v60.76,44.35
  Bottom 0.406: IC7.10 27.79,59.8 27.79,61.34 29.49,63.05 49.02,63.05 59.54,52.53 59.54,51.79 v60.43,50.91
B  (via drill 0.36)
  Top 0.406: v54.03,47.4 54.03,49.38 54.91,50.26 IC5.49
  Route15 0.406: v40.77,19.16 45.19,23.57 45.19,30.56 | 45.19,30.56 45.19,30.59 | 45.19,30.56 53.65,39.02 53.65,39.86 52.51,41 52.51,45.88 v54.03,47.4
  Bottom 0.406: IC10.11 40.74,19.13 v40.77,19.16
B1  (via drill 0.36)
  Top 0.406: v50.98,55.35 50.97,55.34 IC5.54
  Bottom 0.406: IC7.11 29.09,57.31 arc90 29.14,57.26 31.04,55.35 v50.98,55.35
C  (via drill 0.36)
  Top 0.406: 54.11,51.69 IC5.50 54.11,51.67 v54.11,50.63
  Route2 0.406: v45.83,19.16 42.65,22.33 42.65,29.67 51.08,38.1 51.08,39.02 52.48,40.41 52.48,49.58 53.34,50.45 53.93,50.45 v54.11,50.63
  Bottom 0.406: IC10.14 48.16,19.16 v45.83,19.16
C1  (via drill 0.36)
  Top 0.406: v50.09,54.49 50.18,54.4 IC5.55
  Bottom 0.406: IC7.14 29.09,51.34 32.24,54.49 v50.09,54.49
CPA1  (via drill 0.36)
  Top 0.406: IC5.14 arc-90 41.25,39.6 45.11,39.6 48.19,42.67 v49.38,42.67
  Bottom 0.406: v49.38,42.67 50.22,43.51 60.76,43.51 61.95,42.34 64.04,42.34 67.31,45.6 R32.1
CPA2  (via drill 0.36)
  Top 0.406: IC5.35 56.77,39.6 57.66,39.6 57.97,39.91 v57.97,40.16
  Route2 0.406: v67.57,39.09 67.57,47.37 v68.74,48.54
  Route15 0.406: v57.97,40.16 57.94,40.13 57.94,36.81 57.64,36.5 v57.64,36.25
  Bottom 0.406: v57.64,36.25 58.22,36.83 65.76,36.83 67.01,38.08 67.01,38.53 v67.57,39.09 | v68.74,48.54 R33.1
CPA3  (via drill 0.36)
  Top 0.406: v52.53,54.61 arc-90 52.54,54.6 IC5.52
  Route15 0.406: v66.09,47.07 58.55,54.61 v52.53,54.61
  Bottom 0.406: v66.09,47.07 R34.1
CPB1  (via drill 0.36)
  Top 0.406: IC5.60 46.23,51.69 v46.23,52.84
  Route2 0.406: v46.23,52.84 arc90 44.15,54.92 33.71,54.92 32.11,53.32 32.11,45.57 v31.88,45.34
  Bottom 0.406: v31.88,45.34 31.16,45.6 R35.1
CPB2  (via drill 0.36)
  Top 0.406: IC5.5 43.12,46.68 v43.31,46.87
  Bottom 0.406: R36.1 42.52,47.4 v43.31,46.87
CPB3  (via drill 0.36)
  Top 0.406: v54.18,44.25 54.91,43.53 IC5.40
  Bottom 0.406: R37.1 37.34,44.5 37.8,44.96 41.05,44.96 43.28,42.73 48.24,42.73 49.76,44.25 v54.18,44.25
CSA0
  Top 0.406: C27.2 63.54,44.88 62.34,44.88 60.43,42.98 60.43,40.74 58.49,38.8 IC5.34
CSA3  (via drill 0.36)
  Top 0.406: C22.2 34.41,35.31 v35.69,35.31 | v45.44,47.17 45.46,47.18 IC5.61
  Route15 0.406: v35.69,35.31 37.52,37.14 37.52,44.2 40.9,47.58 43.84,47.58 44.25,47.17 v45.44,47.17
CSA4
  Top 0.406: 41.23,48.24 IC5.3 40.25,48.25 35.08,43.08 34.46,43.08 C16.2
CSA5  (via drill 0.36)
  Top 0.406: v62.34,30.36 63.57,30.36 C19.1 63.61,30.74 64.06,31.2 64.57,31.2 65.03,31.65 R6.2 | v44.71,53.47 44.67,53.43 IC5.62
  Route15 0.406: v44.71,53.47 44.86,53.65 55.76,53.65 56.7,52.38 56.7,33.73 60.07,30.36 v62.34,30.36
CSA7  (via drill 0.36)
  Top 0.406: C18.2 34.43,41.61 v35.46,41.61 | v55.35,41.91 55.39,41.95 IC5.38
  Bottom 0.406: v35.46,41.61 38.18,44.33 40.8,44.33 43.21,41.91 v55.35,41.91
CSA9  (via drill 0.36)
  Top 0.406: v35.66,32.11 v35.65,32.12 C24.1 R11.2 | v42.9,44.3 42.89,44.31 IC5.8
  Route15 0.406: v35.66,32.11 42.9,39.35 v42.9,44.3
CSA10
  Top 0.406: IC5.4 40.48,47.46 37.55,44.53 37.55,40.62 35.4,38.47 C20.1 R7.2
CSA11  (via drill 0.36)
  Top 0.406: v36.17,29.32 36.17,28.34 R13.2 36.17,28.29 36.17,27.64 36.43,27.39 37.14,27.39 37.57,26.95 C26.1 | v38.38,42.5 38.62,42.74 IC5.10
  Bottom 0.406: v36.17,29.32 38.38,31.52 v38.38,42.5
CSA13
  Top 0.406: IC5.43 60.19,45.89 62.34,48.03 63.56,48.03 C17.1 R4.2
CSA14  (via drill 0.36)
  Top 0.406: C25.2 63.59,41.66 v62.34,41.66 | v52.56,39.4 52.54,39.39 IC5.29
  Bottom 0.406: v62.34,41.66 60.07,39.4 v52.56,39.4
CSA15  (via drill 0.36)
  Top 0.406: v62.36,33.48 63.62,33.48 C21.1 63.66,33.52 63.66,33.96 64.06,34.37 64.67,34.37 65.03,34.73 R8.2 | v42.93,45.19 42.84,45.1 IC5.7
  Route2 0.406: v59.64,44.35 59.82,44.3 59.82,43.62 58.7,42.5 58.7,35.01 60.23,33.48 v62.36,33.48
  Bottom 0.406: v42.93,45.19 54.74,45.19 55.58,44.35 v59.64,44.35
CSA16  (via drill 0.36)
  Top 0.406: C23.1 63.63,36.7 63.63,37.16 64.01,37.55 64.62,37.55 65.03,37.95 R10.2 65.04,38.48 v65.97,38.48 | IC5.56 49.39,50.16 50.32,49.23 50.32,39.55 v50.35,39.53
  Bottom 0.406: v65.97,38.48 65.94,38.46 62.03,38.46 61.09,37.52 51.41,37.52 50.35,38.59 v50.35,39.53
CSB0  (via drill 0.36)
  Top 0.406: v62.61,43.03 63.59,43.03 C27.1 63.63,43.05 63.63,43.51 64.01,43.89 64.49,43.89 65.03,44.43 R14.2 | v51.77,49.86 51.76,49.88 IC5.53
  Bottom 0.406: v62.61,43.03 61.67,43.97 61.67,47.02 59.64,49.05 58.3,49.05 57.48,49.86 v51.77,49.86
CSB3
  Top 0.406: R9.2 C22.1 35.66,33.49 35.66,33.51 38.61,33.51 42.65,37.55 45.77,37.55 46.26,37.06 46.26,36.17 IC5.21
CSB4
  Top 0.406: IC5.2 39.84,49.04 35.66,44.86 34.44,44.86 C16.1 R3.2
CSB5  (via drill 0.36)
  Top 0.406: C19.2 v62.35,32.12 v62.34,32.13 | v44.58,48.11 43.88,48.81 IC5.63
  Route15 0.406: v62.34,32.13 58.75,34.45 v58.75,48.24
  Bottom 0.406: v58.75,48.24 58.73,48.11 v44.58,48.11
CSB7  (via drill 0.36)
  Top 0.406: R5.2 C18.1 35.65,39.84 v35.66,39.86 | v40.41,38.03 41.23,38.03 IC5.16
  Route2 0.406: v35.66,39.86 38.59,39.86 v40.41,38.03
CSB9  (via drill 0.36)
  Top 0.406: C24.2 34.44,30.28 v35.66,30.28 | v45.47,35.01 45.47,36.15 IC5.20
  Route15 0.406: v35.66,30.28 40.74,30.28 v45.47,35.01
CSB10
  Top 0.406: IC5.13 41.23,40.39 40.36,40.39 36.64,36.67 C20.2
CSB11  (via drill 0.36)
  Top 0.406: v37.57,29.29 C26.2 | v39.45,43.59 39.51,43.53 IC5.9
  Bottom 0.406: v37.57,29.29 39.45,31.17 v39.45,43.59
CSB13
  Top 0.406: C17.2 63.59,46.18 62.36,46.18 61.28,45.1 IC5.42
CSB14  (via drill 0.36)
  Top 0.406: v62.34,39.83 63.59,39.83 C25.1 63.63,39.87 63.63,40.34 64.04,40.74 64.62,40.74 65.03,41.15 R12.2 | v51.77,38.59 51.76,38.57 IC5.28
  Bottom 0.406: v62.34,39.83 61.09,38.59 v51.77,38.59
CSB15  (via drill 0.36)
  Top 0.406: IC5.39 56.77,42.73 v57.87,42.73 | v62.34,35.28 62.35,35.3 C21.2
  Route15 0.406: v61.29,41.99 61.29,35.89 61.9,35.28 v62.34,35.28
  Bottom 0.406: v57.87,42.73 57.89,42.75 60.56,42.75 61.29,42.02 v61.29,41.99
CSB16
  Top 0.406: C23.2 63.57,38.43 62.72,38.43 58.45,34.17 54.72,34.17 54.12,34.76 IC5.31
D  (via drill 0.36)
  Top 0.406: v53.27,48.95 53.33,49.01 IC5.51
  Route2 0.406: v45.83,20.43 45.19,21.06 45.19,30.59 53.27,38.66 v53.27,48.95
  Bottom 0.406: IC10.13 48.16,20.43 v45.83,20.43
D1  (via drill 0.36)
  Top 0.406: v48.59,39.25 48.61,39.23 IC5.24
  Route2 0.406: v42.9,48.49 48.59,42.8 v48.59,39.25
  Bottom 0.406: IC7.13 30.36,51.13 31.37,52.15 36.4,52.15 40.03,48.52 42.88,48.52 v42.9,48.49 42.9,48.52
D+  (via drill 0.36)
  Top 0.406: R31.1 81.08,79.3 84.2,76.18 84.2,72.47 96.22,60.45 96.22,30.97 94.57,29.32 v67.87,29.32 | IC5.23 47.82,32.3 48.87,31.25 57.23,31.25 59.16,29.32 v59.19,29.32
  Route2 0.406: v67.87,29.32 v59.19,29.32
D-  (via drill 0.36)
  Top 0.406: IC5.22 47.03,31.89 48.37,30.56 56.29,30.56 58.55,28.3 v58.58,28.3 | R30.1 82.63,79.2 85.14,76.69 85.14,73.11 95.71,62.54 95.74,62.54 97.21,61.06 97.21,28.96 96.55,28.3 v67.8,28.3
  Route2 0.406: v67.8,28.3 v58.58,28.3
DAC0  (via drill 0.36)
  Top 0.406: IC5.58 47.86,51.72 47.86,61.01 51.03,64.19 75.95,64.19 77.32,65.56 77.32,68.33 74.55,71.1 74.55,78.11 76.1,79.66 v77.04,79.66
  Bottom 0.406: v77.04,79.66 R16.1
DAC1  (via drill 0.36)
  Top 0.406: IC5.59 47.04,51.69 47.04,63.61 44.96,65.69 44.96,67.54 46.13,68.71 70.89,68.71 71.96,69.78 v71.96,74.04
  Bottom 0.406: v71.96,74.04 71.45,74.55 R18.1
GND  (via drill 0.36)
  Top 0.406: IC5.36 56.75,40.36 56.64,40.47 v55.48,40.47 | IC5.12 41.25,41.15 43.62,41.15 44.28,40.49 v44.28,40.44 | IC5.27 50.97,35.4 v50.98,35.34
  Bottom 0.406: C12.2 59.74,41.36 v59.69,41.41 | 44.28,40.49 44.3,40.52 46.89,40.52 47.09,40.31 C13.2 | C32.1 63.07,83.94 IC6.7
  other vias: 41.3,50.57 45.65,57.81 56.82,62.51 66.42,53.11 65.89,84 57.28,84.71 65.66,85.32 85.58,88.85 80.32,88.78 73.41,87.23 52.99,83.09 54.46,92.21 54.16,95.25 60.25,84.92 86.31,82.48 84.36,79.68 77.7,93.78 87.71,93.86 89.54,96.45 76.03,96.35 78.03,88.83 75.47,85.88
  pour Top (isolate 0.406): -2.56,100.69 97.54,100.69 arc-89 98.54,99.7 99.37,24.92 -1.72,24.92
  pour Bottom (isolate 0.406): -2.56,100.69 99.42,100.69 99.22,-1.47 -2.77,-1.47
  pour Route2 (isolate 0.406): -3.78,101.43 100.33,101.32 100.33,-0.81 -3.78,-0.71
GNDANA  (via drill 0.36)
  Top 0.406: IC5.45 58.69,47.46 58.7,47.48 59.52,47.48 64.01,51.97 64.01,52.73 | 64.01,52.73 64.01,61.17 v65.53,62.69 | C11.2 63.99,52.71 64.01,52.73
  Route2 0.406: U$10.P$1 8.82,73.52 8.82,72.47 10.11,71.17 21.01,71.17 | 32.47,71.17 21.01,71.17 | 32.47,71.17 33.12,71.17 | 33.12,71.17 45.44,71.17 | 45.44,71.17 57.46,71.17 | 57.46,71.17 69.73,71.17 | 69.73,71.17 81.69,71.17 | 81.69,71.17 92.23,71.17 93.81,72.75 93.81,72.8 93.79,72.81 U$3.P$1 | U$5.P$1 81.69,73.49 81.69,71.17 | U$4.P$1 69.73,73.46 69.73,71.17 | U$6.P$1 57.46,73.39 57.46,71.17 | U$7.P$1 45.44,73.49 45.44,71.17 | U$9.P$1 33.12,73.44 33.12,71.17 | U$8.P$1 21.01,73.52 21.01,71.17 | 32.47,71.17 32.47,63.68 v34.32,61.83 34.32,60.35 v27.41,53.45 | v65.53,62.69 65.53,66.98 69.73,71.17
  Bottom 0.406: IC4.1 34.82,61.83 v34.32,61.83 | C5.2 8.83,74.83 U$10.P$1 8.84,73.51 C6.2 | L2.2 26.13,52.16 v27.41,53.45
MIDI_OUT
  Bottom 0.406: R23.1 R22.1 38.39,77.34 Q1.3
N$1  (via drill 0.36)
  Top 0.406: R3.1 32.96,42.98 v32.06,42.98 | v5.8,11.53 5.82,11.51 C.1
  Route2 0.406: v32.06,42.98 30.48,41.41 7.06,41.41 v5.8,40.13
  Bottom 0.406: v5.8,40.13 v5.8,11.53
N$2  (via drill 0.36)
  Top 0.406: R5.1 32.94,41.58 v32.06,41.58 | v13.59,23.8 12.8,23.02 C#.1
  Route2 0.406: v32.06,41.58 30.76,40.29 14.2,40.29 12.78,38.87 12.78,24.62 v13.59,23.8
N$3  (via drill 0.36)
  Top 0.406: R7.1 32.93,36.61 v32.16,36.61 | v18.5,11.13 20.22,9.4 D.1
  Route2 0.406: v32.16,36.61 32.13,36.58 21.62,36.58 v18.5,34.62
  Bottom 0.406: v18.5,34.62 v18.5,11.13
N$4  (via drill 0.36)
  Top 0.406: R9.1 32.98,35.31 v32.13,35.31 | v26.06,23.45 27.41,22.61 D#.1
  Route2 0.406: v32.13,35.31 28.55,35.31 26.09,32.85 26.09,23.47 v26.06,23.45
N$5  (via drill 0.36)
  Top 0.406: 32.98,30.31 R11.1 arc-2 32.16,30.31 29.85,30.31 28.35,28.81 v28.35,25.89 | v30.43,5.82 E.1
  Route15 0.406: v28.6,6.78 28.32,7.06 v28.32,11.23
  Bottom 0.406: v28.6,6.78 29.57,5.82 v30.43,5.82 | v28.32,11.23 28.35,11.26 v28.35,25.89
N$6
  Top 0.406: 36.2,26.46 R13.1 36.15,25.66 36.96,24.84 37.67,24.84 45.19,17.33 45.19,7.6 46.97,5.82 F.1
N$7  (via drill 0.36)
  Top 0.406: R14.1 65.83,43.02 v65.84,43.01 | v81.82,22.15 81.82,21.9 A#.1
  Bottom 0.406: v65.84,43.01 67.77,43.01 69.37,41.41 79.23,41.41 80.75,39.88 80.75,23.22 v81.82,22.15
N$8  (via drill 0.36)
  Top 0.406: R4.1 65.8,46.2 v65.81,46.21 | v92.87,17.99 92.87,6.51 B.1
  Route15 0.406: v65.81,46.21 86.8,46.21 92.87,40.13 v92.87,17.99
N$9  (via drill 0.36)
  Top 0.406: R12.1 65.06,39.88 v65.94,39.88 | v77.8,11.26 77.78,11.23 A.1
  Bottom 0.406: v65.94,39.88 75.9,39.88 77.8,37.98 v77.8,11.26
N$10  (via drill 0.36)
  Top 0.406: R10.1 65.09,36.61 65.94,36.61 66.3,36.96 66.3,37.19 67.26,38.15 v68.03,38.15 | v70.16,23.8 70.59,23.37 G#.1
  Bottom 0.406: v68.03,38.15 69.32,38.15 70.16,37.32 v70.16,23.8
N$11  (via drill 0.36)
  Top 0.406: R8.1 65.04,33.51 v65.79,33.51 | G.1 63.38,19.79 v63.38,20.3
  Route15 0.406: v65.79,33.51 66.65,32.64 66.65,23.55 63.4,20.3 v63.38,20.3
N$12
  Top 0.406: R6.1 64.88,30.17 64.88,23.6 59.8,18.52 F#.1
N$13
  Bottom 0.406: R17.1 C28.2
N$14
  Bottom 0.406: R17.2 R15.1 C29.1 66.11,80.74 IC6.8
N$15
  Bottom 0.406: R19.1 C33.2
N$16  (via drill 0.36)
  Top 0.406: v59.52,76.61 v67.59,76.61
  Bottom 0.406: C34.1 R20.1 58.73,80.71 58.73,78.08 59.5,77.31 | 59.5,77.31 IC6.4 | R19.2 67.6,76.6 v67.59,76.61 | v59.52,76.61 59.52,77.3 59.5,77.31
N$17  (via drill 0.36)
  Top 0.406: v70.97,87.05 69.46,88.56 69.09,88.93 68.22,89.8 U$1.P$3
  Bottom 0.406: R15.2 v70.97,87.05
N$18
  Bottom 0.406: 58.74,82.55 R20.2 58.78,82.56 58.78,90 56.15,92.62 U$2.P$3
N$19
  Bottom 0.406: C31.2 61.8,75.3 IC6.3
N$20
  Top 1.27: J1.PWR 94.14,83.74 S1.3
N$22
  Bottom 0.406: IC8.5 27.74,83.06 35.34,83.06 36.76,84.48 37.95,84.48 39.96,82.48 39.96,77.88 39.64,77.56 R22.2
N$23
  Top 0.406: R1.1 92.2,56.67 93.04,55.83 93.04,54.69 LED1.A
N$24  (via drill 0.36)
  Top 0.406: LED4.A LED5.C 90.91,44.35 90.58,44.02 81.89,44.02 81.38,44.53 LED3.C LED2.A v77.27,45.34
  Bottom 0.406: v77.27,45.34 70.04,45.34 R32.2
N$25  (via drill 0.36)
  Top 0.406: LED4.C LED5.A LED7.A LED6.C 84.56,49.76 83.9,50.42 75.8,50.42 75.01,49.63 75.01,48.87 LED8.A LED10.C 71.86,47.48 v71.5,47.12
  Bottom 0.406: v71.5,47.12 69.86,47.12 R34.2
N$26
  Bottom 0.406: IC4.3 39.44,61.67 L1.1
N$28
  Bottom 0.406: OK1.2 15.44,78.84 arc-90 R25.2 15.07,79.11 15.07,77.88 14.21,77.03 D1.C
N$29  (via drill 0.36)
  Top 0.406: LED9.A LED11.C 26.5,44.99 v27.23,44.99 | LED7.C LED6.A 84.56,45.67 LED3.A LED2.C v77.27,48.84 v77.27,48.85 | v36.33,49 39.75,52.43 v39.75,57.79
  Route15 0.406: v36.33,49 36.3,49.02 34.14,49.02 30.33,45.22 27.82,45.22 27.59,44.99 v27.23,44.99 | v39.75,57.79 42.14,60.33 v56.39,60.33
  Bottom 0.406: v77.27,48.85 70.14,48.85 R33.2 69.84,52.8 63.61,59.03 57.69,59.03 v56.39,60.33
N$30  (via drill 0.36)
  Top 0.406: LED14.A LED15.C 7.09,47.78 7.78,47.09 16.08,47.09 16.62,46.56 LED13.C | LED13.C LED12.A | LED10.A LED8.C 74.98,45.29 v74.98,44.35 | v38.66,58.55 38.66,55.25 v33.12,49.71 | v16.59,46.21 16.59,45.37 LED13.C
  Route2 0.406: v74.98,44.35 74.98,47.65 64.09,58.55 v38.66,58.55
  Route15 0.406: v33.12,49.71 30,46.59 27.84,46.59 v27.79,46.54
  Bottom 0.406: 27.79,45.95 R35.2 | 27.79,45.95 v16.59,46.21 | v27.79,46.54 27.79,45.95
N$31  (via drill 0.36)
  Top 0.406: LED14.C LED15.A LED17.A LED16.C 13.44,44.96 14.38,44.02 27.92,44.02 v28.4,44.5
  Bottom 0.406: R37.2 v28.4,44.5
N$32  (via drill 0.36)
  Top 0.406: LED17.C LED16.A LED13.A LED12.C LED9.C LED11.A 26.14,48.06 v26.8,47.4
  Bottom 0.406: R36.2 v26.8,47.4
N$37
  Bottom 0.406: C28.1 C30.2 75.95,81.07 75.95,81.54 76.05,81.64 76.74,81.64 77.04,81.94 R16.2
N$38
  Bottom 0.406: C35.2 R18.2 71.45,78.08 70.89,77.52 70.39,77.52 69.93,77.07 69.93,76.62 C33.1
N$41  (via drill 0.36)
  Top 0.406: S14.P$1 S13.P$1 S12.P$1 S11.P$1 90.25,32.85 88.47,34.62 88.47,40.34 90.38,42.24 S15.P$1 | S15.P$1 S16.P$1 S17.P$1 S18.P$1 68.05,43.49 66.86,44.68 66.86,49.61 v66.83,49.63 | S3.P$1 S4.P$1 S5.P$1 S6.P$1 5.39,42.24 3.03,39.88 3.03,35.31 5.41,32.92 7.01,32.92 S10.P$1 S9.P$1 S8.P$1 S7.P$1 | R27.1 31.86,46.16 29.95,48.06 S3.P$1 | v31.22,49.61 29.95,49.61 S3.P$1 | S15.P$1
  Route2 0.406: v57.81,50.6 56.95,51.46 v33.1,51.46
  Bottom 0.406: v66.83,49.63 58.78,49.63 v57.81,50.6 | v31.22,49.61 32.21,50.6 32.24,50.6 v33.1,51.46
N$43  (via drill 0.36)
  Top 0.406: v27.36,35.79 29.8,35.79 S3.P$2
  Route15 0.406: v36.3,16.59 28.02,16.59 27.36,17.25 v27.36,35.79
  Bottom 0.406: v36.3,16.59 IC10.9
N$44  (via drill 0.36)
  Top 0.406: v20.63,34.85 21.24,34.85 S4.P$2
  Route15 0.406: v36.3,15.34 21.7,15.37 19.79,17.27 19.79,34.01 v20.63,34.85
  Bottom 0.406: IC10.8 36.33,15.32 v36.3,15.34
N$46  (via drill 0.36)
  Top 0.406: v13.69,35.97 14.68,35.97 S5.P$2
  Route15 0.406: v36.3,14.08 14.71,14.08 11.53,17.25 11.53,34.47 13.03,35.97 v13.69,35.97
  Bottom 0.406: IC10.7 v36.3,14.08
N$47  (via drill 0.36)
  Top 0.406: v4.93,35.89 7.04,35.89 S6.P$2
  Route15 0.406: v36.3,12.78 8.36,12.8 3.94,17.23 3.94,34.9 v4.93,35.89
  Bottom 0.406: IC10.6 v36.3,12.78
N$48  (via drill 0.36)
  Top 0.406: S7.P$2 29.95,23.98 v29.9,23.93
  Bottom 0.406: IC10.5 30.84,11.53 29.95,12.42 29.95,23.88 v29.9,23.93
N$49  (via drill 0.36)
  Top 0.406: S8.P$2 v22.33,25.15
  Bottom 0.406: IC10.4 24.89,10.24 22.33,12.8 v22.33,25.15
N$50  (via drill 0.36)
  Top 0.406: v14.71,25.05 S9.P$2
  Bottom 0.406: IC10.3 16.67,8.97 14.71,10.92 v14.71,25.05
N$51  (via drill 0.36)
  Top 0.406: v7.12,25.12 7.12,26.52 S10.P$2
  Bottom 0.406: IC10.2 14.76,7.7 7.12,15.34 v7.12,25.12
N$52  (via drill 0.36)
  Top 0.406: v90.91,25.18 S11.P$2
  Bottom 0.406: IC10.23 83.29,7.73 90.91,15.34 v90.91,25.18
N$53  (via drill 0.36)
  Top 0.406: v83.27,25.15 83.27,26.52 S12.P$2
  Bottom 0.406: IC10.22 79.45,8.99 83.27,12.8 v83.27,25.15
N$54  (via drill 0.36)
  Top 0.406: v75.67,25.1 S13.P$2
  Bottom 0.406: IC10.21 72.14,10.24 75.67,13.77 v75.67,25.1
N$55  (via drill 0.36)
  Top 0.406: S14.P$2 v68.05,25.07
  Bottom 0.406: IC10.20 64.34,11.51 68.05,15.22 v68.05,25.07
N$56  (via drill 0.36)
  Top 0.406: v94.69,34.67 93.42,35.94 S15.P$2
  Route15 0.406: v50.27,12.78 89.69,12.78 94.69,17.78 v94.69,34.67
  Bottom 0.406: v50.27,12.78 IC10.19
N$57  (via drill 0.36)
  Top 0.406: v85.68,35.97 83.32,35.97 S16.P$2
  Route15 0.406: v50.27,14.05 83.95,14.05 87.12,17.23 87.12,34.52 v85.68,35.97
  Bottom 0.406: v50.27,14.05 IC10.18
N$58  (via drill 0.36)
  Top 0.406: v76.79,35.94 S17.P$2 | S17.P$2
  Route15 0.406: v50.27,15.32 76.97,15.32 78.87,17.23 78.87,33.86 v76.79,35.94
  Bottom 0.406: v50.27,15.32 IC10.17
N$59  (via drill 0.36)
  Top 0.406: S18.P$2 v69.12,35.94 | S18.P$2
  Route15 0.406: v50.27,16.59 70.56,16.59 71.22,17.25 71.22,33.84 v69.12,35.94
  Bottom 0.406: v50.27,16.59 IC10.16
N$68
  Bottom 0.406: IC8.4 36.46,81.79 31.93,81.79 31.4,81.26 R21.1
N$72
  Bottom 0.406: R25.1 15.91,81.76 IC9.4
N$73
  Bottom 0.406: OK1.3 17.91,80.06 14.05,80.06 12.79,81.33 D1.A 12.17,82.07 11.33,82.91 6.07,82.91 IC9.5
N$99
  Top 0.406: X.2 83.56,89.47 82.93,88.85 D2.C | D2.C 82.93,82.97 R30.2 | D2.C
N$100
  Top 0.406: X.3 82.76,89.72 81.28,88.24 81.28,84.59 D3.C 81.08,84.28 R31.2 81.03,82.69
POT1
  Bottom 0.254: IC7.9 26.55,61.34 25.96,61.93 24.36,61.93 19.84,66.45 19.84,68.89 20.32,69.37 88.14,69.37 91.32,72.55 91.32,73.5 U$3.P$2
POT2
  Bottom 0.254: U$5.P$2 79.3,73.45 79.3,72.47 76.66,69.83 19.92,69.83 19.28,69.19 19.28,66.22 19.31,66.22 24.13,61.39 25,61.39 25.28,61.12 IC7.8
POT3
  Bottom 0.254: IC7.7 23.98,59.8 23.98,60.84 18.75,66.07 18.75,69.4 19.64,70.28 64.95,70.28 67.19,72.52 67.19,73.5 U$4.P$2
POT4
  Bottom 0.254: IC7.6 22.74,61.24 18.21,65.76 18.21,69.57 19.48,70.84 53.34,70.84 55.07,72.57 55.07,73.5 U$6.P$2
POT5
  Bottom 0.254: IC7.5 21.47,61.8 17.61,65.66 17.61,69.73 19.18,71.3 41.71,71.3 42.98,72.57 42.98,73.45 U$7.P$2
POT6
  Bottom 0.254: IC7.4 20.2,62.36 17,65.56 17,69.93 18.93,71.86 29.9,71.86 30.74,72.7 30.74,73.5 U$9.P$2
POT7
  Bottom 0.254: IC7.3 18.93,62.87 16.31,65.48 16.31,70.28 18.52,72.5 U$8.P$2
POT8
  Bottom 0.406: IC7.2 17.66,61.17 14.66,64.16 8.97,64.16 6.33,66.81 U$10.P$2
RESETN  (via drill 0.36)
  Top 0.406: C10.1 75.77,57.51 76.05,57.23 76.86,57.23 77.25,56.85 R2.1 77.26,56.31 79.2,56.31 81.56,53.95 83.37,53.95 S2.P$2 83.39,52.58 83.85,52.12 v84.84,52.12 84.87,52.15 | IC5.30 v53.33,34.28
  Route2 0.406: v84.84,52.12 84.84,30.23 82.02,27.41 50.27,27.41 JTAG.6
  Route15 0.406: v53.33,34.28 53.33,32.98 50.27,29.93 50.27,27.41 JTAG.6
RXD  (via drill 0.36)
  Top 0.406: v49.02,52.76 48.75,53.04 48.75,59.36 v48.72,59.39 | v24.67,68.3 26.5,70.13 v26.5,81.06 | v51.29,46.48 51.29,41.99 53.98,39.3 53.98,38.48 54.89,37.57 54.89,36.17 IC5.32
  Route2 0.406: v51.29,46.48 50.96,46.82 v50.96,49.79 | v48.72,59.39 48.72,63.86 v48.75,63.88 | v24.67,68.3 24.67,68.38
  Bottom 0.406: OK1.6 24.25,79.97 R26.2 | v50.96,49.79 49.02,51.72 v49.02,52.76 | R26.2 27.43,80.17 | v26.5,81.06 27.23,80.32 R26.2 | v48.75,63.88 48.39,64.24 45.7,64.24 41.27,68.67 25.04,68.67 v24.67,68.3
TCK  (via drill 0.36)
  Top 0.406: v43.89,38.81 43.27,38.8 IC5.15
  Bottom 0.406: JTAG.1 43.95,38.81 v43.89,38.81
TDI  (via drill 0.36)
  Top 0.406: JTAG.9 43.92,31.2 v42.02,33.1 | v43.92,45.88 41.25,45.88 IC5.6
  Route2 0.406: v42.02,33.1 42.02,42.02 43.92,43.92 v43.92,45.88
TDO  (via drill 0.36)
  Top 0.406: v43.08,34.17 43.09,34.18 IC5.17
  Bottom 0.406: v43.08,34.17 47.4,34.17 51.54,30.03 JTAG.3
TMS
  Top 0.406: JTAG.5 43.92,33.76 43.92,36.12 IC5.18
TXD  (via drill 0.36)
  Top 0.406: v41.38,53.42 41.41,53.45 41.41,68.81 32.54,77.68 v32.54,80.27 | v51.72,47.4 52.17,46.94 52.17,42.19 55.25,39.12 55.25,38.61 55.81,38.05 56.72,38.05 IC5.33
  Route15 0.406: v51.72,47.4 50.12,49 v47.12,49
  Bottom 0.406: v47.12,49 45.34,50.78 42.45,50.78 41.38,51.84 v41.38,53.42 | Q1.2 R24.1 32.58,80.23 v32.54,80.27
USB_5V
  Top 0.406: X.1 84.36,88.31 arc-90 R28.2
VBUS  (via drill 0.36)
  Top 0.406: 84.74,86.22 R28.1 | 84.74,86.22 R29.2 | IC5.44 59.86,46.68 64.93,51.74 64.93,59.29 v68.3,62.66 | 84.74,86.22 84.74,85.68 84.69,85.63 84.69,82.02 85.91,80.8 85.91,73.41 89.87,69.45 v90.66,69.45
  Bottom 0.406: v68.3,62.66 87.81,62.66 90.66,65.51 v90.66,69.45
VCC  (via drill 0.36)
  Top 0.406: IC5.25 49.38,36.17 v49.38,38.64 | R2.2 v77.25,58.86 | IC5.11 41.23,41.94 v40.26,41.94 | C15.1 43.06,53.71 v43.06,52.61 43.06,51.64 IC5.64 43.08,51.67 40.97,51.67 36.94,47.63 C2.1 R27.2 v35.39,46.16 | v57.94,41.18 57.93,41.16 IC5.37
  Bottom 0.406: JTAG.4 51.54,24.97 50.93,24.36 C37.1 arc90 50.59,21.67 38.89,21.67 38.13,20.91 IC10.12 C38.1 | C14.1 40.4,41.94 v40.26,41.94 | C12.1 58.41,41.18 v57.94,41.18 50.1,41.18 C13.1 49.38,40.17 v49.38,38.64 | R24.2 34.1,78.46 v35.11,78.46 35.24,78.33 Q1.1 | C36.1 31.78,56.9 30.33,58.35 30.33,59.74 IC7.12 30.36,60.86 31.3,61.8 v32.11,61.8 | v60.48,60.81 60.48,62.26 IC3.2
  pour Route15 (isolate 0.305): -4.92,101.55 100.36,101.55 100.36,-0.76 -4.92,-0.76
VCCANA  (via drill 0.36)
  Top 0.406: 59.19,52.71 59.19,53.42 51.56,61.04 v49.63,61.04 | 59.19,52.71 59.19,49.63 58.55,49 56.8,49 IC5.47 IC5.46 | 59.19,52.71 C11.1
  Route15 0.406: U$10.P$3 3.89,73.46 3.89,72.44 5.16,71.17 15.95,71.17 | 28.12,71.17 40.29,71.17 | 40.29,71.17 40.36,71.17 | 28.12,71.17 15.95,71.17 | 40.36,71.17 52.58,71.17 | 52.58,71.17 64.72,71.17 | 64.72,71.17 76.74,71.17 | 76.74,71.17 87.12,71.17 88.79,72.84 U$3.P$3 | U$5.P$3 76.74,73.52 76.74,71.17 | U$4.P$3 64.72,73.46 64.72,71.17 | U$6.P$3 52.58,73.51 52.58,71.17 | U$7.P$3 40.36,73.49 40.36,71.17 | U$9.P$3 28.12,73.44 28.12,71.17 | U$8.P$3 15.95,73.46 15.95,71.17 | 40.29,71.17 42.62,68.84 v42.62,61.6 49.08,61.6 v49.63,61.04
  Bottom 0.406: C5.1 3.83,74.58 U$10.P$3 | C6.1 16.01,73.51 U$8.P$3 | v42.62,61.6 L1.2
VDDCORE
  Top 0.406: IC5.26 50.18,34.29 C9.1 C8.1
VIN  (via drill 0.36)
  Top 0.406: IC2.3 68.58,59.64 68.58,58.32 v68.61,58.3 | 28.27,59.69 IC1.3 28.3,57.91 v28.27,57.89 | v87.66,56.62 89.27,56.62 R1.2
  Top 1.27: v7.32,57.15 C1.A
  Route15 0.406: v28.27,57.89 28.25,57.87 28.25,56.62 | v36.5,57.48 36.5,56.62 | 68.61,56.62 v68.61,58.3 | v62.77,60.58 62.77,56.72 62.66,56.62
  Route15 1.27: v7.32,57.15 7.85,56.62 28.25,56.62 36.5,56.62 62.66,56.62 68.61,56.62 81.54,56.62 | 81.54,56.62 96.35,71.43 96.35,75.09 94.75,76.69 92.59,76.69 91.6,77.68 S1.2 | 81.54,56.62 v87.66,56.62
  Bottom 0.406: 36.5,57.99 36.5,61.3 IC4.2 | 36.5,57.99 v36.5,57.48 | v28.27,57.89 27.31,56.92 27.21,56.92 27.2,56.94 C7.1 12.82,56.98 | IC4.4 36.48,58.02 36.5,57.99 | v62.77,60.58 IC3.3
VO1  (via drill 0.36)
  Top 0.406: U1.TIP 44.86,81.63 47.07,79.43 v61.75,79.43
  Route15 0.406: v67.47,82.53 64.37,79.43 v61.75,79.43
  Bottom 0.406: U$1.P$1 U$1.P$2 70.72,89.56 68.51,87.35 68.51,82.54 C29.2 68.47,82.53 v67.47,82.53 | v61.75,79.43 62.34,79.43 62.69,79.07 63.99,79.07 64.34,78.72 IC6.1
VO2  (via drill 0.36)
  Top 0.406: U1.RING 57.5,93.72 58.65,94.87 U$2.P$2
  Route15 0.406: v56.19,86.67 58.65,89.13 U$2.P$2
  Bottom 0.406: U$2.P$2 U$2.P$1 | v56.19,86.67 56.19,82.59 C34.2 56.24,82 56.62,81.61 59.97,81.61 60.53,82.17 IC6.5
X  (via drill 0.36)
  Top 0.406: IC5.19 44.68,36.15 44.68,34.29 45.29,33.68 v45.29,33.48
  Route15 0.406: v40.77,6.43 40.77,6.63 39.17,8.23 39.17,27.16 45.29,33.28 v45.29,33.48
  Bottom 0.406: v40.77,6.43 IC10.1
X1  (via drill 0.36)
  Top 0.406: v48.62,49.76 48.61,49.77 IC5.57 | v19.79,54.26 15.34,58.7 v15.34,59.8
  Route15 0.406: v48.62,49.76 34.17,49.76 33.15,50.78 23.27,50.78 v19.79,54.26
  Bottom 0.406: IC7.1 16.36,59.8 v15.34,59.8

### Text on the board
tPlace: On/Off | Power | Reset | nullspacelabs.com
bPlace: charliex/mmca | v1.0